# EasyEDA Pro project pcb-project.epro

# Schematic SCH

## Sheets
1 P1: Create Date: 2024-03-08; Page Name: P1; Project Name: 15P1D_EDA; Schematic Name: SCH; Update Date: 2024-04-02; Company: EDA设计与开发; Page Size: A4; Version: V1.0
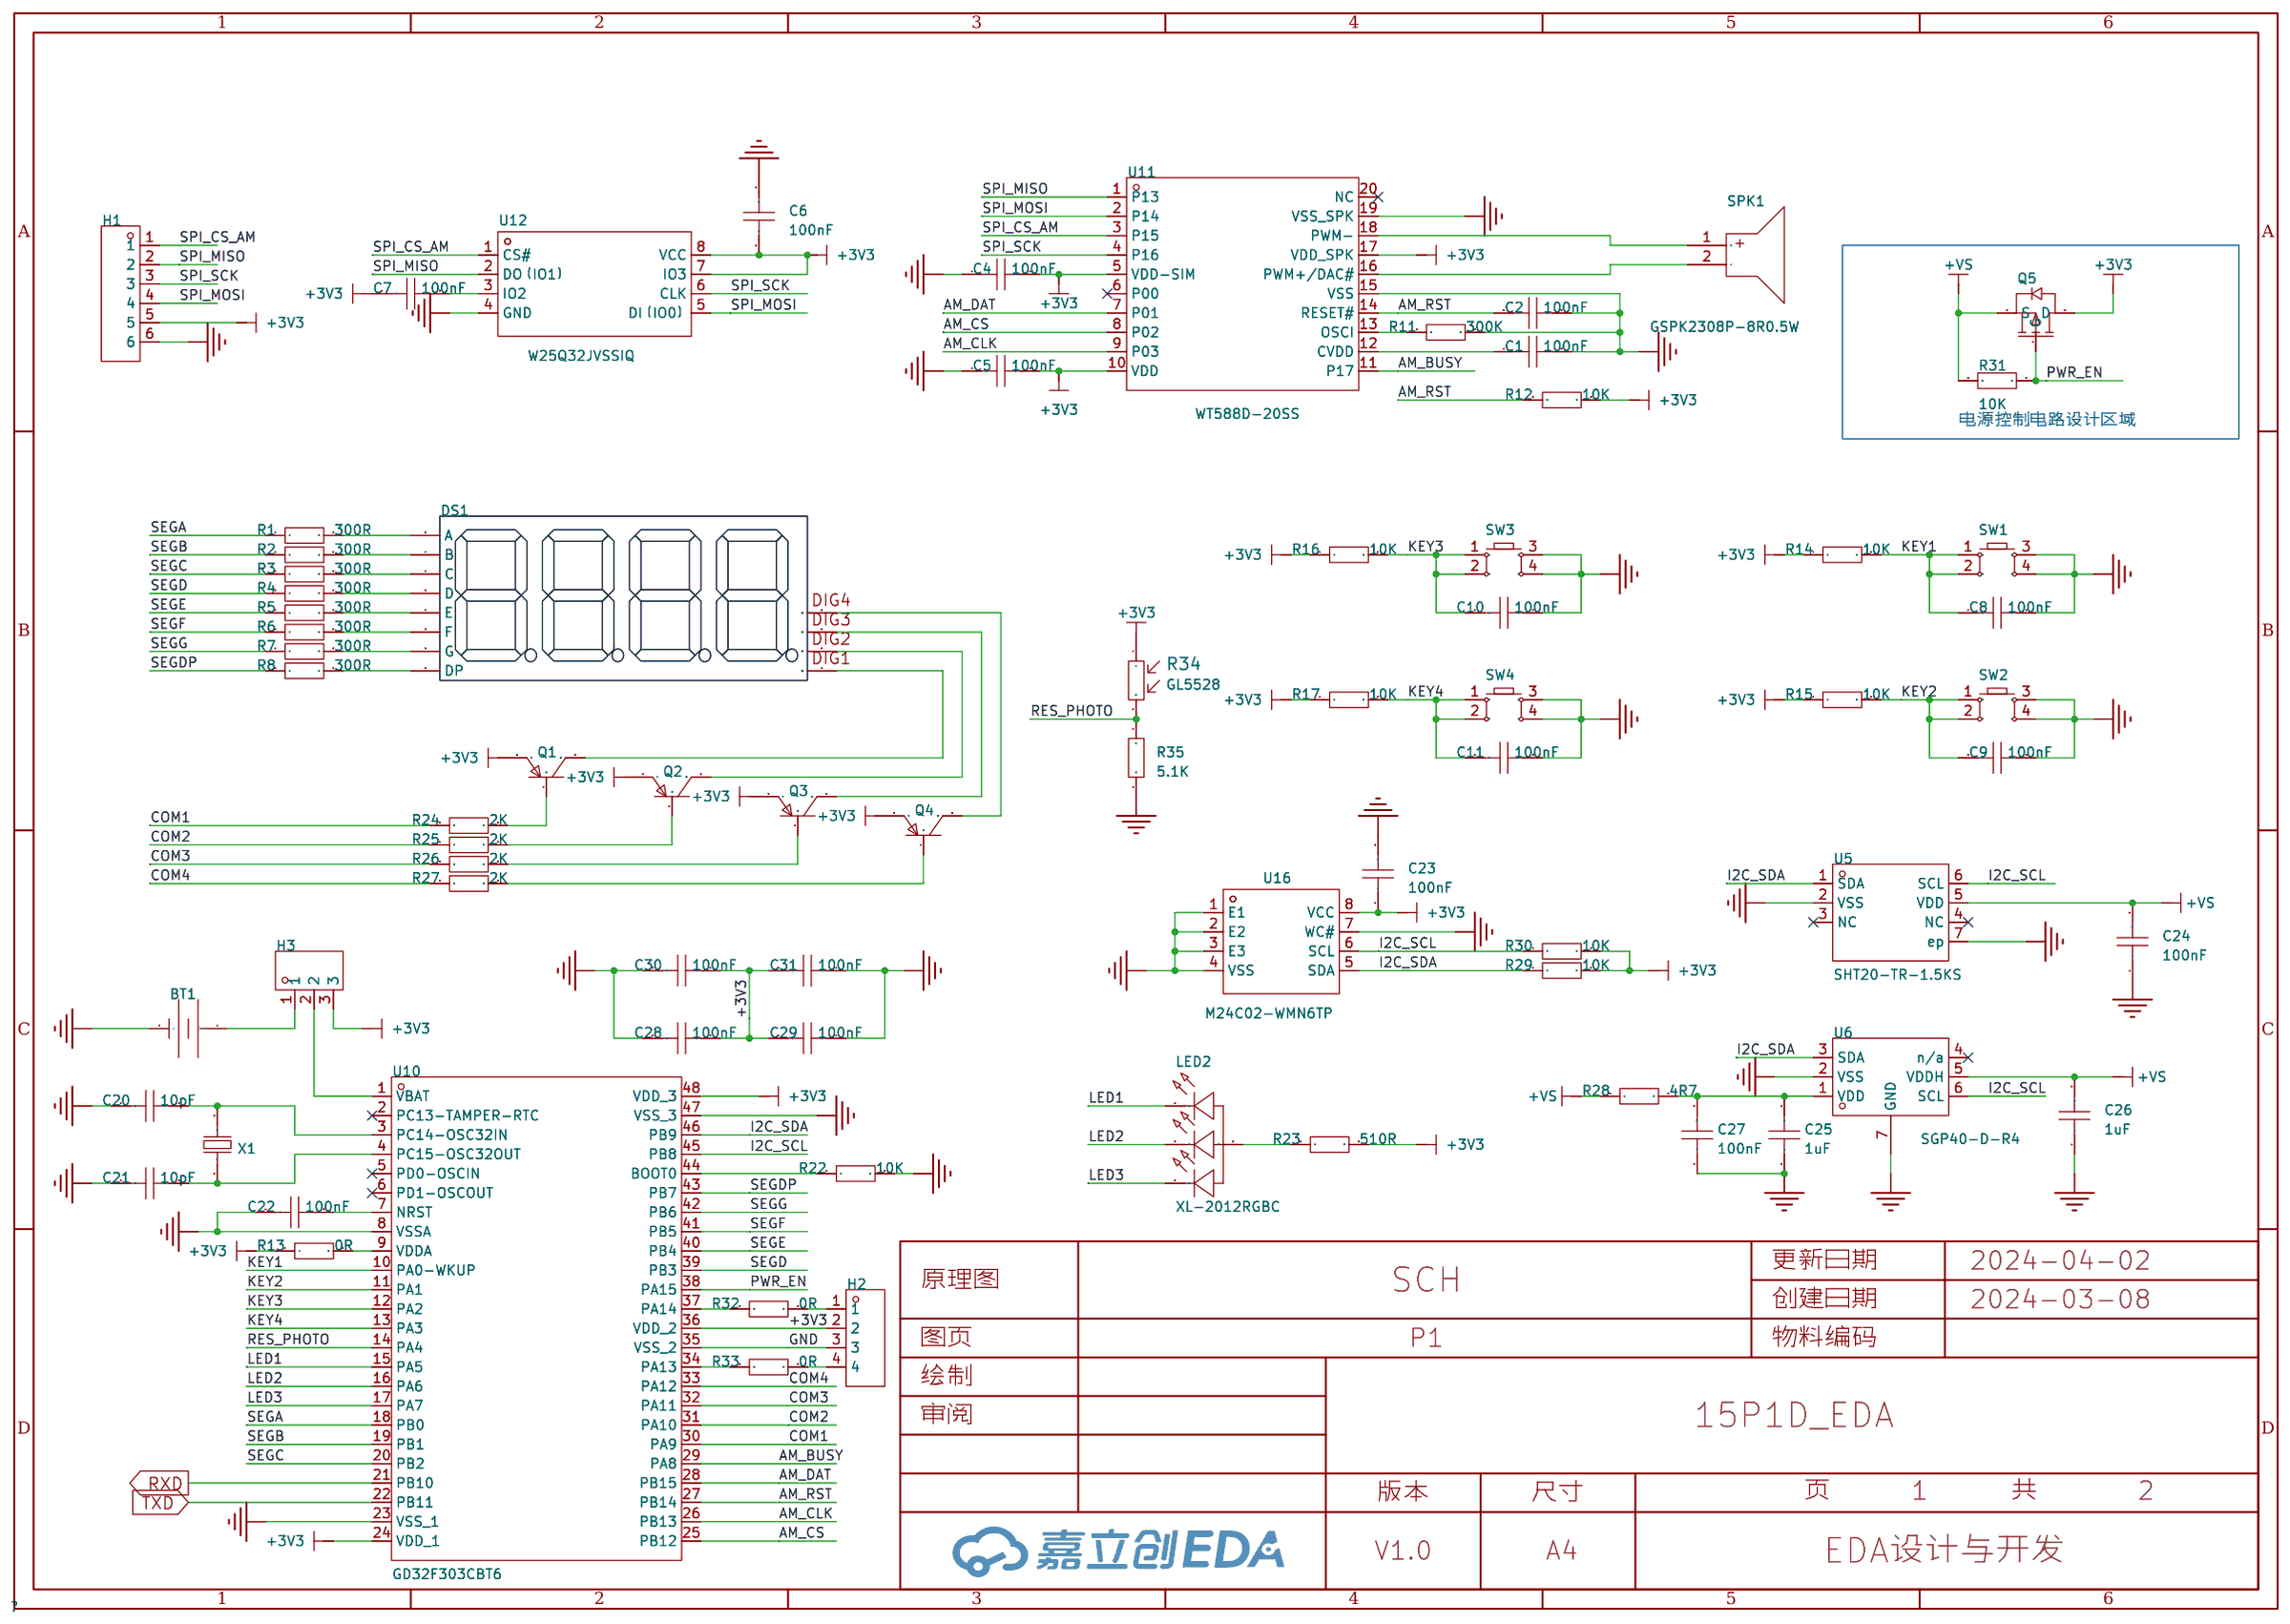
[diagram p0: P1]
2 P2: Create Date: 2024-03-12; Page Name: P2; Update Date: 2024-03-21; Company: 嘉立创EDA
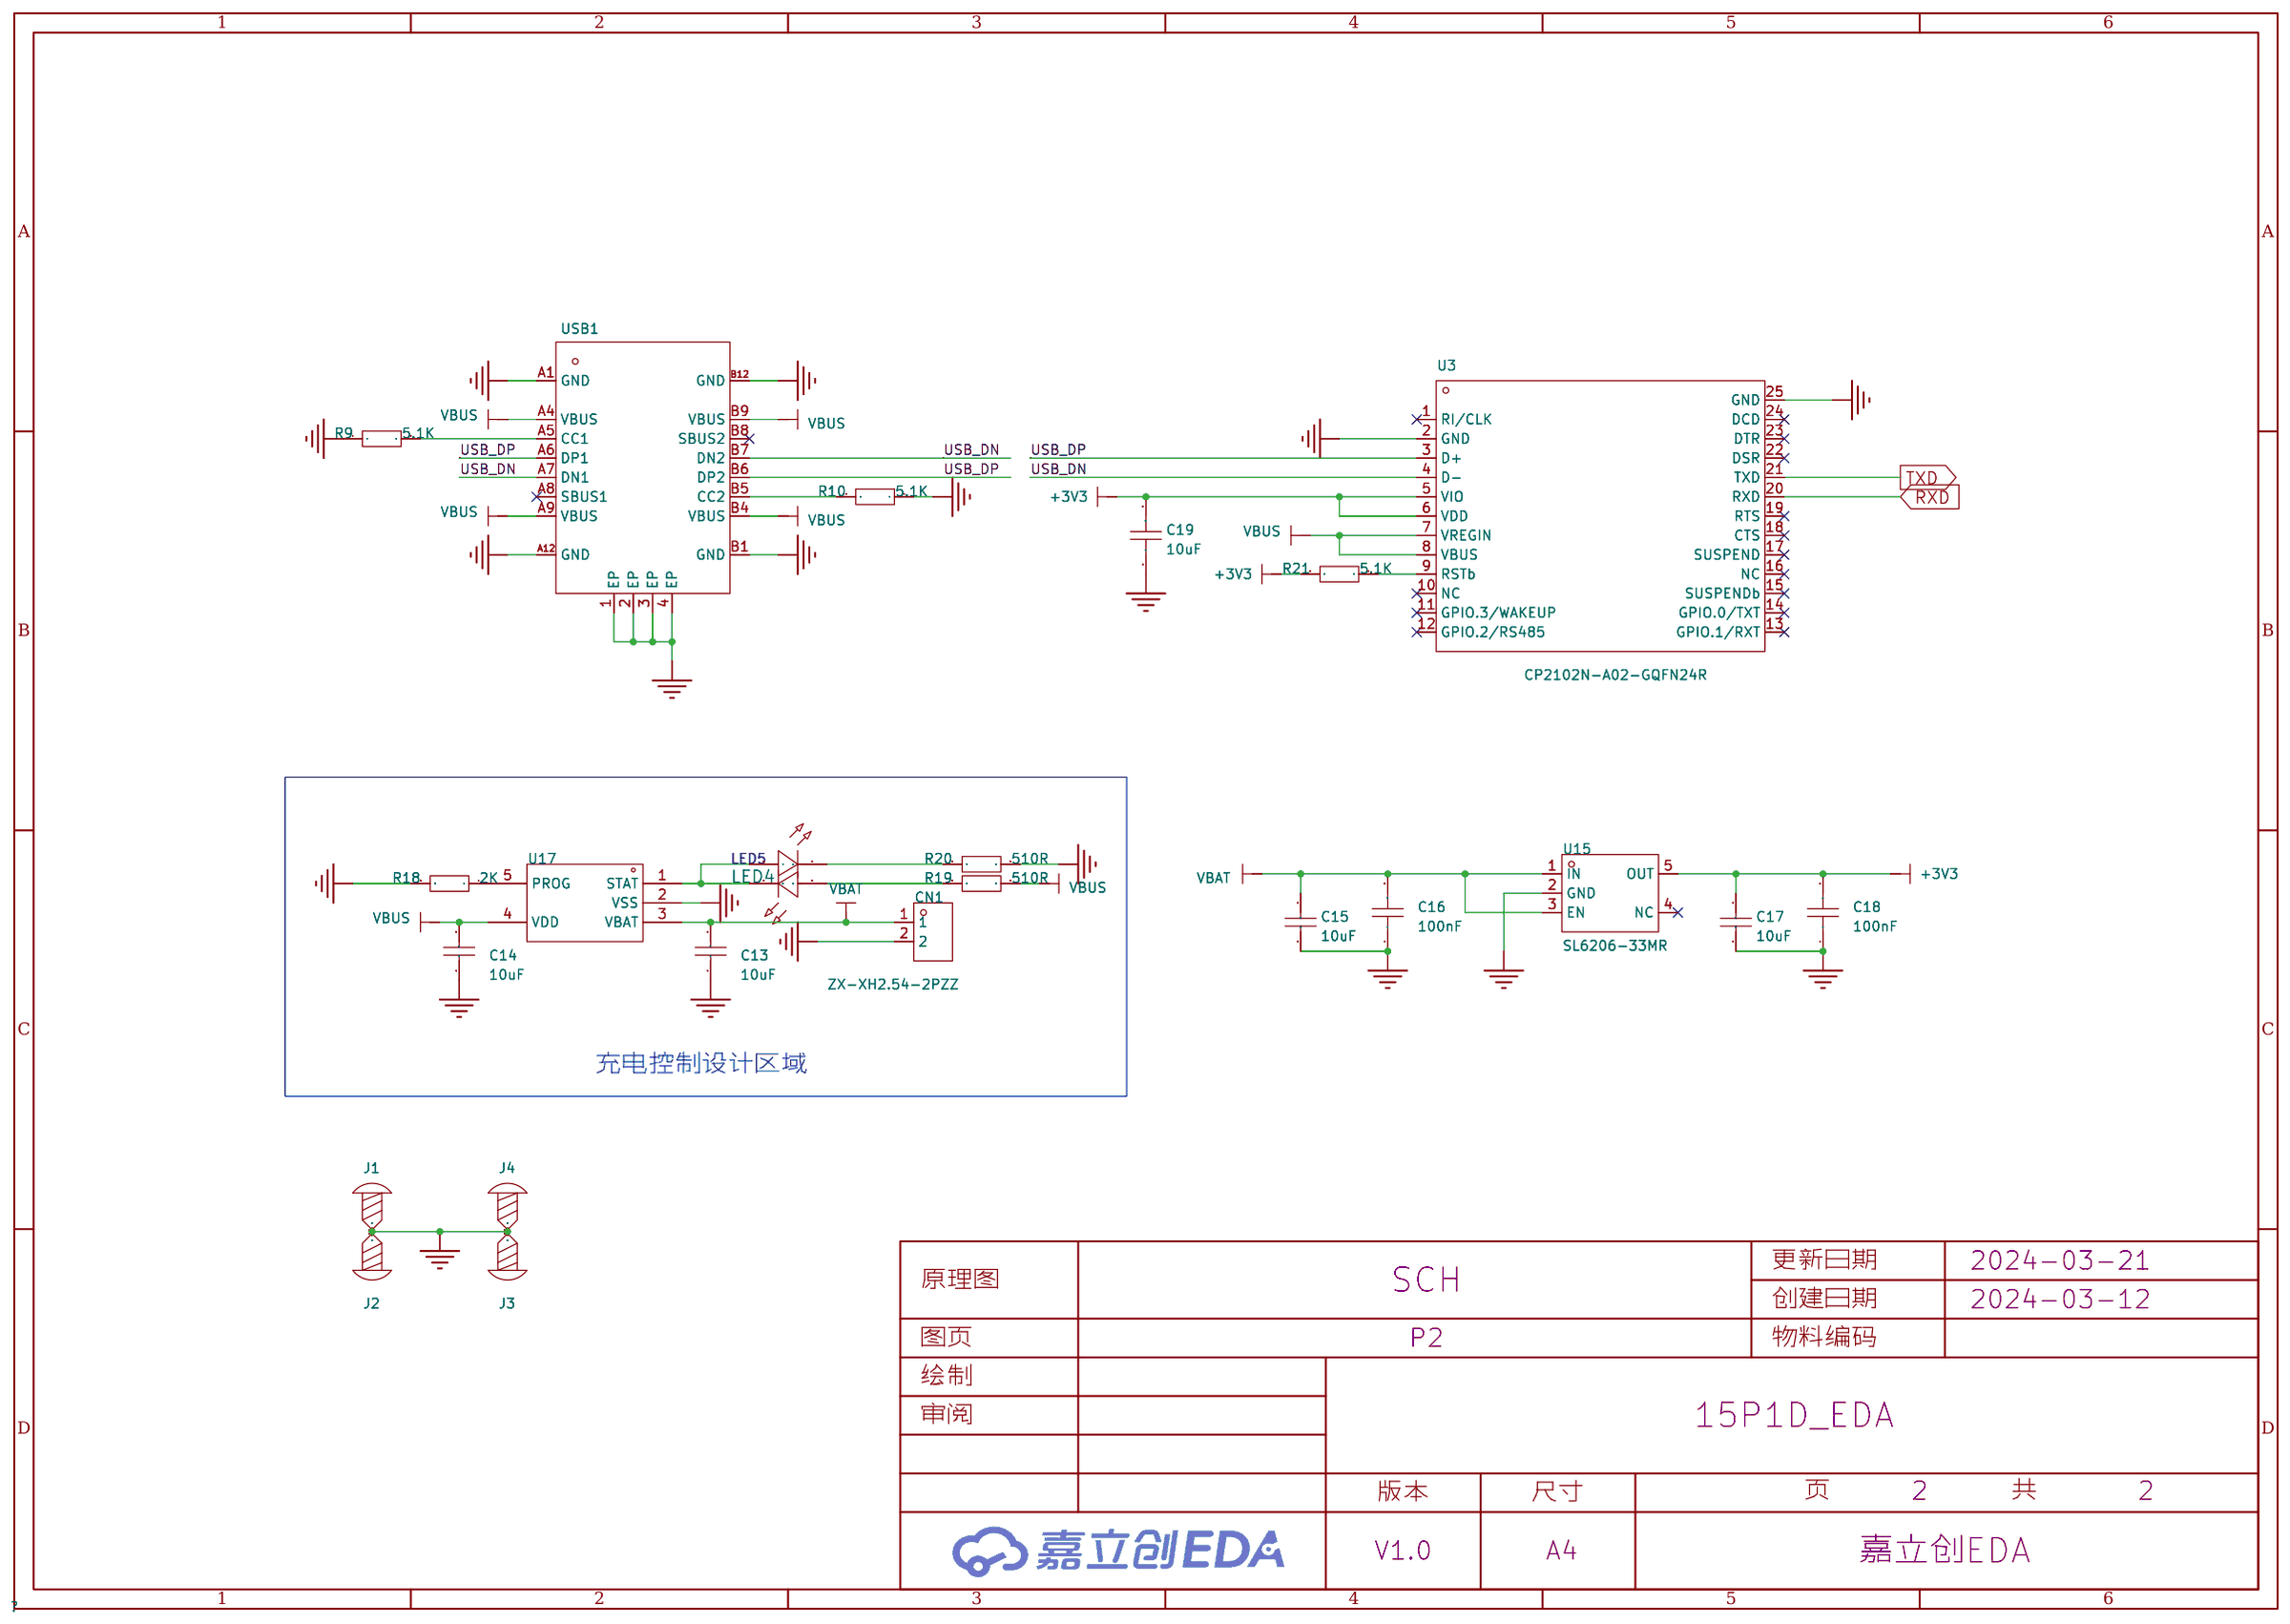
[diagram p1: P2]

## Parts
sheet P1
BT1  BS-12-B3AA003  [BAT-SMD_BS-12-B3AA011]
C1  100nF  [C0805]
C2  100nF  [C0805]
C4  100nF  [C0805]
C5  100nF  [C0805]
C6  100nF  [C0805]
C7  100nF  [C0805]
C8  100nF  [C0805]
C9  100nF  [C0805]
C10  100nF  [C0805]
C11  100nF  [C0805]
C20  10pF  [C0805]
C21  10pF  [C0805]
C22  100nF  [C0805]
C23  100nF  [C0805]
C24  100nF  [C0805]
C25  1uF  [C0805]
C26  1uF  [C0805]
C27  100nF  [C0805]
C28  100nF  [C0805]
C29  100nF  [C0805]
C30  100nF  [C0805]
C31  100nF  [C0805]
DS1  -  [LED-SEG-TH_FJ5461AH]
H1  -  [HDR-TH_6P-P2.54-V-F]
H2  -  [HDR-TH_4P-P2.54-V-F]
H3  Jumper3  [HDR-TH_3P-P2.54-V-M-A]
LED2  XL-2012RGBC  [LED-SMD_4P-L2.0-W1.3-BR]
Q1  -  [S8550P_SOT]
Q2  -  [S8550P_SOT]
Q3  -  [S8550P_SOT]
Q4  -  [S8550P_SOT]
Q5  -  [AO3401A_SOT-23-3]
R1  300R  [R0805]
R2  300R  [R0805]
R3  300R  [R0805]
R4  300R  [R0805]
R5  300R  [R0805]
R6  300R  [R0805]
R7  300R  [R0805]
R8  300R  [R0805]
R11  300K  [R0805]
R12  10K  [R0805]
R13  0R  [R0805]
R14  10K  [R0805]
R15  10K  [R0805]
R16  10K  [R0805]
R17  10K  [R0805]
R22  10K  [R0805]
R23  510R  [R0805]
R24  2K  [R0805]
R25  2K  [R0805]
R26  2K  [R0805]
R27  2K  [R0805]
R28  4R7  [R0805]
R29  10K  [R0805]
R30  10K  [R0805]
R31  10K  [R0805]
R32  0R  [R0805]
R33  0R  [R0805]
R34  GL5528  [RES-TH_L5.1-W4.3-P3.40-D0.5]
R35  5.1K  [R0805]
SPK1  GSPK2308P-8R0.5W  [SPK-TH_BD23.0-P10.00-D0.8-L-RD]
SW1  -  [Key_SMD_12x12x7.3]
SW2  -  [Key_SMD_12x12x7.3]
SW3  -  [Key_SMD_12x12x7.3]
SW4  -  [Key_SMD_12x12x7.3]
U5  SHT20-TR-1.5KS  [DFN-6_L3.0-W3.0-P0.95-TR-EP]
U6  SGP40-D-R4  [DFN-6_L2.4-W2.4-P0.80-TL-EP]
U10  GD32F303CBT6  [LQFP-48_L7.0-W7.0-P0.50-LS9.0-BL]
U11  WT588D-20SS  [SSOP-20_L7.2-W5.3-P0.65-LS7.8-BL]
U12  W25Q32JVSSIQ  [SOIC-8_L5.3-W5.3-P1.27-LS8.0-BL]
U16  M24C02-WMN6TP  [SOIC-8_L4.9-W3.9-P1.27-LS6.0-BL]
X1  32.768kHz  [FC-135R_L3.2-W1.5]
sheet P2
C13  10uF  [C1206]
C14  10uF  [C1206]
C15  10uF  [C1206]
C16  100nF  [C0805]
C17  10uF  [C1206]
C18  100nF  [C0805]
C19  10uF  [C0805]
CN1  ZX-XH2.54-2PZZ  [CONN-TH_2P-P2.50_HX25003-2A]
J1  -  [M2螺丝]
J2  -  [M2螺丝]
J3  -  [M2螺丝]
J4  -  [M2螺丝]
LED4  -  [LED_0805]
LED5  -  [LED_0805]
R9  5.1K  [R0805]
R10  5.1K  [R0805]
R18  2K  [R0805]
R19  510R  [R0805]
R20  510R  [R0805]
R21  5.1K  [R0805]
U3  CP2102N-A02-GQFN24R  [QFN-24_L4.0-W4.0-P0.50-TL-EP2.6]
U15  SL6206-33MR  [SOT-23-5_L2.9-W1.6-P0.95-LS2.8-BL]
U17  -  [SOP_BCON]
USB1  -  [USB_TYPE-C-16P]

## Library data of the parts
BT1 = BS-12-B3AA003: 连接器类型:电池底座;适用电池规格:CR1220;工作温度范围:-25℃~+85℃;; Supplier Part: C964723; Manufacturer: MYOUNG(美阳); Supplier Footprint: SMD; JLCPCB Part Class: 扩展库; Datasheet: https://atta.szlcsc.com/upload/public/pdf/source/20201218/C964723_733B638E287393F86295A2A4DAE43C75.pdf; Supplier: LCSC; Connector Type: 电池底座; Battery Type: CR1220; Operating Temperature Range: -25℃~+85℃
C1 C2 C4-C11 C16 C18-C31 = CAP_0805: Supplier Footprint: 0805
DS1 = LED_SEG_TH_0.56x4: Supplier Footprint: 插件
H1 = HDR-F_2.54_1x6P: Supplier Part: C40877; Supplier Footprint: 插件
H2 = HDR-F_2.54_1x4P: Supplier Part: C2718488; Supplier Footprint: 插件
H3 = Jumper3: Supplier Part: C2940050; Supplier Footprint: HDR-TH-3P-2.54mm; JLCPCB Part Class: 扩展库; Supplier: LCSC
LED2 = XL-2012RGBC: 发光颜色:RGB三色;功率:80mW；80mW；55mW;正向电流:25mA;主波长:619nm~624nm；463nm~466nm；524nm~527nm;二极管配置:-;透镜颜色:无色透明透镜;色温:-;发光角度:120°;载带方式:正贴;工作温度:-30℃~+85℃;; Supplier Part: C965848; Manufacturer: XINGLIGHT(成兴光); Supplier Footprint: 0805; JLCPCB Part Class: 扩展库; Datasheet: https://atta.szlcsc.com/upload/public/pdf/source/20221102/35E310354F68AE1BCFC07B93F5E395D6.pdf; Supplier: LCSC; Emitted Color: RGB三色; Power Dissipation: 80mW；80mW；55mW; Forward Current: 25mA; Dominant Wavelength: 619nm~624nm；463nm~466nm；524nm~527nm; Peak Wavelength: 624nm；528nm；469nm; Lens Color: 无色透明透镜; Viewing Angle: 120°; Mounting Sytle: 正贴; Operating Temperature: -30℃~+85℃
Q1-Q4 = S8550_SOT_PNP: Supplier Footprint: SOT-23
Q5 = AO3401A_P: Supplier Footprint: SOT-23-3L; Supplier Part: C15127
R1-R33 R35 = Res_0805: Supplier Footprint: 0805
R34 = GL5528: 暗电阻:1MΩ;亮电阻 @ 10Lux:8kΩ~20kΩ;光谱峰值(波长):540nm;; LCSC Part Name: 亮电阻:8kΩ~20kΩ 暗电阻:1MΩ; Supplier Part: C125627; Manufacturer: 森霸; Supplier Footprint: 插件,P=3mm; JLCPCB Part Class: 扩展库; Datasheet: https://atta.szlcsc.com/upload/public/pdf/source/20230427/842A99E3D53A83729D7968886D4EFCBB.pdf; Supplier: LCSC; Dark Resistance: 1MΩ; Illuminated Resistance @ 10Lux: 8kΩ~20kΩ; Applied Voltage: 150V; Spectral Peak: 540nm
SPK1 = GSPK2308P-8R0.5W: Supplier Part: C530532; Manufacturer: INGHAi(赢海); JLCPCB Part Class: 扩展库; Datasheet: https://atta.szlcsc.com/upload/public/pdf/source/20200723/C530532_3DB1F973601B36F20FBCCA52751811A3.pdf; Supplier: LCSC
SW1-SW4 = Key_SMD_12x12x7.3: Supplier Footprint: SMD
U5 = SHT20-TR-1.5KS: 接口类型:I2C;; LCSC Part Name: 1-100706-01; Supplier Part: C53865; Manufacturer: Sensirion(瑞士盛思锐); Supplier Footprint: DFN-6-EP(3x3); JLCPCB Part Class: 扩展库; Datasheet: https://atta.szlcsc.com/upload/public/pdf/source/20151012/1457707445424.pdf; Supplier: LCSC; Interface Type: I2C; Supply Voltage: 2.1V~3.6V
U6 = SGP40-D-R4: 气体类型:空气质量;精度:-;; LCSC Part Name: 3.000.384; Supplier Part: C2874215; Manufacturer: Sensirion(瑞士盛思锐); Supplier Footprint: DFN-6-EP(2.4x2.4); JLCPCB Part Class: 扩展库; Datasheet: https://atta.szlcsc.com/upload/public/pdf/source/20231011/67A6038984BE66B07B1FF2325C50691F.pdf; Supplier: LCSC; Type: 空气质量; Operating Temperature: -10℃~+50℃
U10 = GD32F303CBT6_C3013779: CPU内核:CM4;程序存储容量:128KB;RAM总容量:32KB;GPIO端口数量:37;工作电压范围:-;CPU最大主频:120MHz;程序存储器类型:FLASH;; Supplier Part: C3013779; Manufacturer: GigaDevice(兆易创新); Supplier Footprint: LQFP-48(7x7); JLCPCB Part Class: 扩展库; Datasheet: https://atta.szlcsc.com/upload/public/pdf/source/20220624/E1A57ED816B162D6D1424864911A792F.pdf; Supplier: LCSC; CPU Core: CM4; Program Storage Size: 128KB; RAM Size: 32KB; GPIO Ports Number: 37; CPU Maximum Speed: 120MHz; Program Memory Type: FLASH; ADC (Bit): 12bit; DAC (Bit): 12bit; 16Bit Timer: 7; CAN: 1; UART/USART: 3; I2C: 2; I2S: 2; SPI: 3; Peripheral/Function: 看门狗；RTC实时时钟; Watchdog: 有; Real-Time Clock: 有
U11 = WT588D-20SS: 高品质语音芯片; Supplier Part: C87498; Manufacturer: WT(唯创知音); Supplier Footprint: SSOP-20-208mil; JLCPCB Part Class: 扩展库; Datasheet: https://atta.szlcsc.com/upload/public/pdf/source/20161217/1481939141189.pdf; Supplier: LCSC
U12 = W25Q32JVSSIQ_C82344: 接口类型:SPI;存储容量:32Mbit;; Supplier Part: C82344; Manufacturer: WINBOND(华邦); Supplier Footprint: SOIC-8-208mil; JLCPCB Part Class: 扩展库; Datasheet: https://atta.szlcsc.com/upload/public/pdf/source/20160910/1473490310454.pdf; Supplier: LCSC; Interface Type: SPI; Memory Size: 32Mbit; Supply Voltage: 2.7V~3.6V; Page Programming Time (Tpp): 3ms; Operating Temperature: -40℃~+85℃
U16 = M24C02-WMN6TP: 接口类型:I2C;存储容量:2Kbit;; Supplier Part: C7562; Manufacturer: ST(意法半导体); Supplier Footprint: SOIC-8; JLCPCB Part Class: Extended Part; Datasheet: https://atta.szlcsc.com/upload/public/pdf/source/20140724/1457707167301.pdf; Supplier: LCSC; Interface Type: I2C; Memory Size: 2Kbit; Supply Voltage: 2.5V~5.5V; Operating Temperature: -40℃~+85℃
X1 = Q13FC13500004_C32346: 晶振类型:贴片晶振;频率:32.768kHz;常温频差:±20ppm;外接负载电容:12.5pF;; LCSC Part Name: 32.768kHz ±20ppm 12.5pF; Supplier Part: C32346; Manufacturer: EPSON(爱普生); Manufacturer Part: Q13FC13500004; Supplier Footprint: SMD3215-2P; JLCPCB Part Class: 基础库; Datasheet: https://atta.szlcsc.com/upload/public/pdf/source/20190108/C32346_746D6B07EAF90824457A96480007685F.pdf; Supplier: LCSC; Crystal Type: 贴片晶振; Normal temperature Frequency Tolerance: ±20ppm; External load capacitor: 12.5pF; Equivalent Series Resistance (ESR): 70kΩ; Operating Temperature: -40℃~+85℃
C13-C15 C17 = CL31A106KBHNNNE: 容值:10uF;精度:±10%;额定电压:50V;材质(温度系数):X5R;; LCSC Part Name: 10uF ±10% 50V; Supplier Part: C13585; Manufacturer: SAMSUNG(三星); Supplier Footprint: 1206; JLCPCB Part Class: 基础库; Datasheet: https://atta.szlcsc.com/upload/public/pdf/source/20160218/1457707763339.pdf; Supplier: LCSC; Tolerance: ±10%; Voltage Rated: 50V; Temperature Coefficient: X5R
CN1 = ZX-XH2.54-2PZZ: 插针结构:1x2P;间距:2.54mm;安装方式:直插;参考系列:XH;总PIN数:2P;排数:1;每排PIN数:2;行距:-;额定电流:3A;触头材质:黄铜;触头镀层:锡;工作温度范围:-25℃~+85℃;; Supplier Part: C7429632; Manufacturer: Megastar(兆星); Supplier Footprint: 插件,P=2.54mm; JLCPCB Part Class: 扩展库; Datasheet: https://atta.szlcsc.com/upload/public/pdf/source/20230619/19BA6947230AA44A04D3EDD65E618FD0.pdf; Supplier: LCSC; Pins Structure: 1x2P; Pitch: 2.54mm; Mounting Style: 直插; Reference Series: XH; Number of Pins: 2P; Number of Rows: 1; Number of PINs Per Row: 2; Current Rating (Max): 3A; Contact Material: 黄铜; Contact Plating: 锡; Operating Temperature Range: -25℃~+85℃
J1-J4 = M2螺丝: Supplier Footprint: 插件
LED4 = LED_0805-R: Supplier Footprint: 0805
LED5 = LED_0805-G: Supplier Footprint: 0805
U3 = CP2102N-A02-GQFN24R: 应用功能:USB转UART;接口协议:UART;; Supplier Part: C969151; Manufacturer: SKYWORKS/SILICON LABS(芯科); Supplier Footprint: QFN-24-EP(4x4); JLCPCB Part Class: 扩展库; Datasheet: https://atta.szlcsc.com/upload/public/pdf/source/20201204/C964632_F2B790CC23A72455AEF523510305B30A.pdf; Supplier: LCSC; Applications Function: USB转UART; Protocol: UART; Supply Voltage: 3V~3.6V; Operating Temperature: -40℃~+85℃@(Ta)
U15 = SL6206-33MR: 输出类型:-;; Supplier Part: C707122; Manufacturer: Slkor(萨科微); Supplier Footprint: SOT-23-5; JLCPCB Part Class: 扩展库; Datasheet: https://atta.szlcsc.com/upload/public/pdf/source/20200721/C707121_33633D17E61D5DC97F22208BE63A0FB1.pdf; Supplier: LCSC
U17 = BCON
USB1 = USB_TYPE-C-16P: Supplier Footprint: SMD

## Nets
+3V3: C4.2 C5.2 C6.2 C7.1 C17.2 C18.2 C19.2 C23.1 C28.1 C29.2 C30.1 C31.2 H1.5 H2.2 H3.3 Q1.2(E) Q2.2(E) Q3.2(E) Q4.2(E) Q5.3(D) R12.2 R13.1 R14.1 R15.1 R16.1 R17.1 R21.2 R23.2 R29.2 R30.2 R34.1 U3.5(VIO) U3.6(VDD) U10.24(VDD_1) U10.36(VDD_2) U10.48(VDD_3) U11.5(VDD-SIM) U11.10(VDD) U11.17(VDD_SPK) U12.7(IO3) U12.8(VCC) U15.5(OUT) U16.8(VCC)
GND: BT1.2(-) C1.2 C2.2 C4.1 C5.1 C6.1 C8.2 C9.2 C10.2 C11.2 C13.2 C14.2 C15.1 C16.1 C17.1 C18.1 C19.1 C20.1 C21.1 C22.1 C23.2 C24.1 C25.1 C26.1 C27.1 C28.2 C29.1 C30.2 C31.1 CN1.2 H1.6 H2.3 J1.1 J2.1 J3.1 J4.1 R9.1 R10.1 R11.2 R18.2 R20.1 R22.2 R35.2 SW1.3 SW1.4 SW2.3 SW2.4 SW3.3 SW3.4 SW4.3 SW4.4 U3.2(GND) U3.25(GND) U5.2(VSS) U5.7(ep) U6.2(VSS) U6.7(GND) U10.8(VSSA) U10.23(VSS_1) U10.35(VSS_2) U10.47(VSS_3) U11.15(VSS) U11.19(VSS_SPK) U12.4(GND) U15.2(GND) U16.1(E1) U16.2(E2) U16.3(E3) U16.4(VSS) U16.7(WC#) U17.2(VSS) USB1.1(EP) USB1.2(EP) USB1.3(EP) USB1.4(EP) USB1.A1(GND) USB1.A12(GND) USB1.B1(GND) USB1.B12(GND)
VBAT: C13.1 C15.2 C16.2 CN1.1 U15.1(IN) U15.3(EN) U17.3(VBAT)
VBUS: C14.1 R19.1 U3.7(VREGIN) U3.8(VBUS) U17.4(VDD) USB1.A4(VBUS) USB1.A9(VBUS) USB1.B4(VBUS) USB1.B9(VBUS)
+VS: C24.2 C26.2 Q5.2(S) R28.1 R31.2 U5.5(VDD) U6.5(VDDH)
AM_BUSY: U10.29(PA8) U11.11(P17)
AM_CLK: U10.26(PB13) U11.9(P03)
AM_CS: U10.25(PB12) U11.8(P02)
AM_DAT: U10.28(PB15) U11.7(P01)
AM_RST: C2.1 R12.1 U10.27(PB14) U11.14(RESET#)
COM1: R24.1 U10.30(PA9)
COM2: R25.1 U10.31(PA10)
COM3: R26.1 U10.32(PA11)
COM4: R27.1 U10.33(PA12)
I2C_SCL: R30.1 U5.6(SCL) U6.6(SCL) U10.45(PB8) U16.6(SCL)
I2C_SDA: R29.1 U5.1(SDA) U6.3(SDA) U10.46(PB9) U16.5(SDA)
KEY1: C8.1 R14.2 SW1.1 SW1.2 U10.10(PA0-WKUP)
KEY2: C9.1 R15.2 SW2.1 SW2.2 U10.11(PA1)
KEY3: C10.1 R16.2 SW3.1 SW3.2 U10.12(PA2)
KEY4: C11.1 R17.2 SW4.1 SW4.2 U10.13(PA3)
LED1: LED2.1 U10.15(PA5)
LED2: LED2.2 U10.16(PA6)
LED3: LED2.4 U10.17(PA7)
PWR_EN: Q5.1(G) R31.1 U10.38(PA15)
RES_PHOTO: R34.2 R35.1 U10.14(PA4)
RXD: U3.20(RXD) U10.21(PB10)
SEGA: R1.1 U10.18(PB0)
SEGB: R2.1 U10.19(PB1)
SEGC: R3.1 U10.20(PB2)
SEGD: R4.1 U10.39(PB3)
SEGDP: R8.1 U10.43(PB7)
SEGE: R5.1 U10.40(PB4)
SEGF: R6.1 U10.41(PB5)
SEGG: R7.1 U10.42(PB6)
SPI_CS_AM: H1.1 U11.3(P15) U12.1(CS#)
SPI_MISO: H1.2 U11.1(P13) U12.2(DO（IO1）)
SPI_MOSI: H1.4 U11.2(P14) U12.5(DI（IO0）)
SPI_SCK: H1.3 U11.4(P16) U12.6(CLK)
TXD: U3.21(TXD) U10.22(PB11)
USB_DN: U3.4(D-) USB1.A7(DN1) USB1.B7(DN2)
USB_DP: U3.3(D+) USB1.A6(DP1) USB1.B6(DP2)
$1N1449: DS1.8(DIG3) Q3.3(C)
$1N1467: DS1.1(E) R5.2
$1N1471: DS1.2(D) R4.2
$1N1475: DS1.3(DP) R8.2
$1N1479: DS1.4(C) R3.2
$1N1483: DS1.5(G) R7.2
$1N1487: DS1.11(A) R1.2
$1N1491: DS1.7(B) R2.2
$1N1495: DS1.10(F) R6.2
$1N6161: C1.1 U11.12(CVDD)
$1N6192: R11.1 U11.13(OSCI)
$1N6375: SPK1.1(+) U11.18(PWM-)
$1N6384: SPK1.2(-) U11.16(PWM+/DAC#)
$1N6917: C7.2 U12.3(IO2)
$1N7212: R13.2 U10.9(VDDA)
$1N7925: C20.2 U10.3(PC14-OSC32IN) X1.1
$1N7930: C21.2 U10.4(PC15-OSC32OUT) X1.2
$1N8028: R22.1 U10.44(BOOT0)
$1N8104: LED2.3 R23.1
$1N8256: DS1.12(DIG1) Q1.3(C)
$1N8335: DS1.9(DIG2) Q2.3(C)
$1N8343: DS1.6(DIG4) Q4.3(C)
$1N8477: Q1.1(B) R24.2
$1N8481: Q2.1(B) R25.2
$1N8485: Q3.1(B) R26.2
$1N8489: Q4.1(B) R27.2
$1N8598: C22.2 U10.7(NRST)
$1N9384: C25.2 C27.2 R28.2 U6.1(VDD)
$1N9794: R32.1 U10.37(PA14)
$1N9795: H2.1 R32.2
$1N9824: R33.1 U10.34(PA13)
$1N9825: H2.4 R33.2
$1N10132: BT1.1(+) H3.1
$1N10135: H3.2 U10.1(VBAT)
$2N394: R9.2 USB1.A5(CC1)
$2N397: R10.2 USB1.B5(CC2)
$2N1836: R21.1 U3.9(RSTb)
$2N6293: R18.1 U17.5(PROG)
$2N6364: LED4.1(C) LED5.2(A) U17.1(STAT)
$2N6379: LED5.1(C) R20.2
$2N6385: LED4.2(A) R19.2

Not connected (* = marked no-connect by the designer): U3 1(RI/CLK)* 10(NC)* 11(GPIO.3/WAKEUP)* 12(GPIO.2/RS485)* 13(GPIO.1/RXT)* 14(GPIO.0/TXT)* 15(SUSPENDb)* 16(NC)* 17(SUSPEND)* 18(CTS)* 19(RTS)* 22(DSR)* 23(DTR)* 24(DCD)*; U5 3(NC)* 4(NC)*; U6 4(n/a)*; U10 2(PC13-TAMPER-RTC)* 5(PD0-OSCIN)* 6(PD1-OSCOUT)*; U11 6(P00)* 20(NC)*; U15 4(NC)*; USB1 A8(SBUS1)* B8(SBUS2)*

## Notes on the sheets
sheet 1
- 电源控制电路设计区域
sheet 2
- 充电控制设计区域

# Board PCB
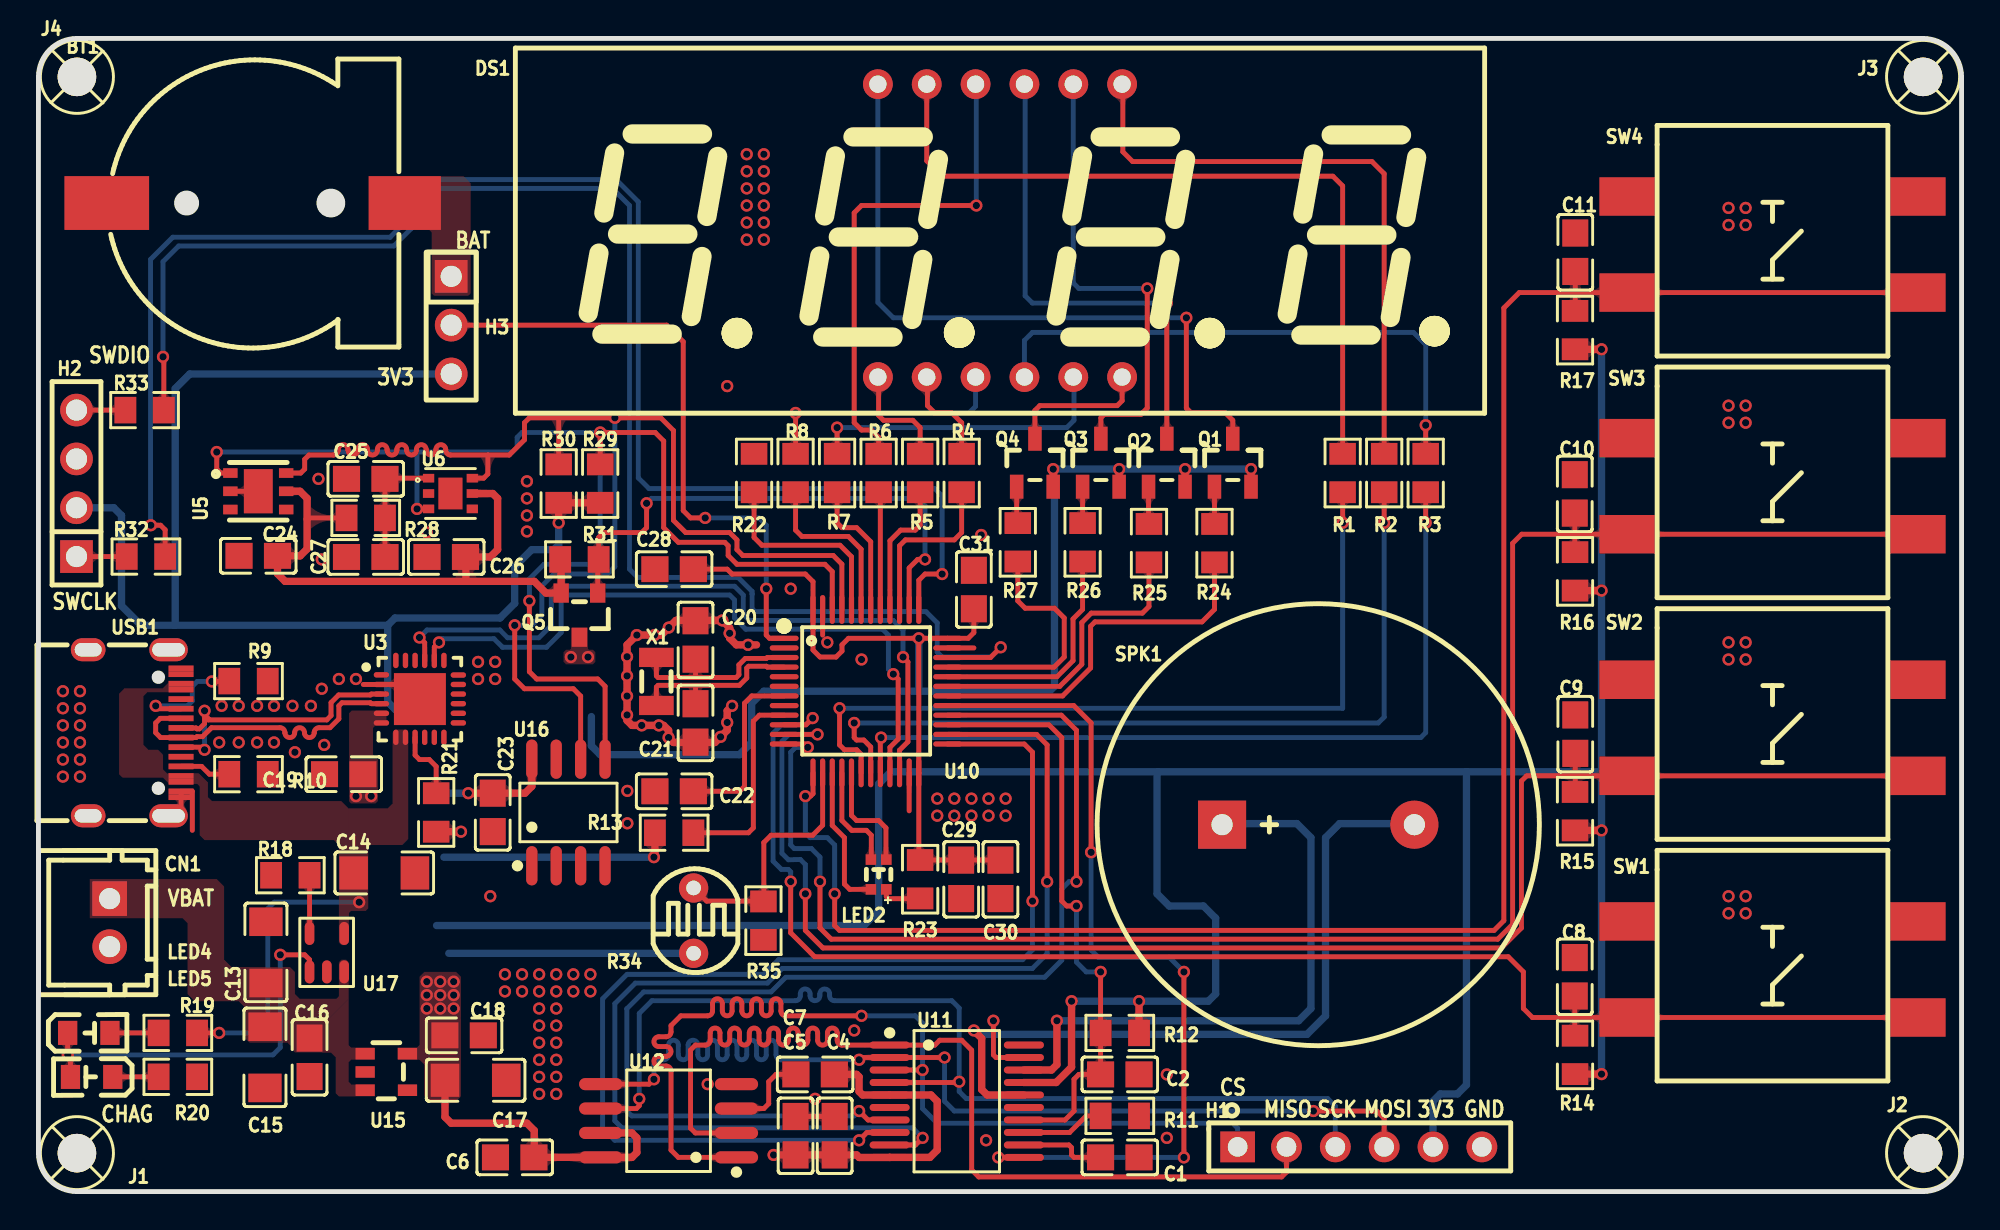
[diagram p2: board, top side]
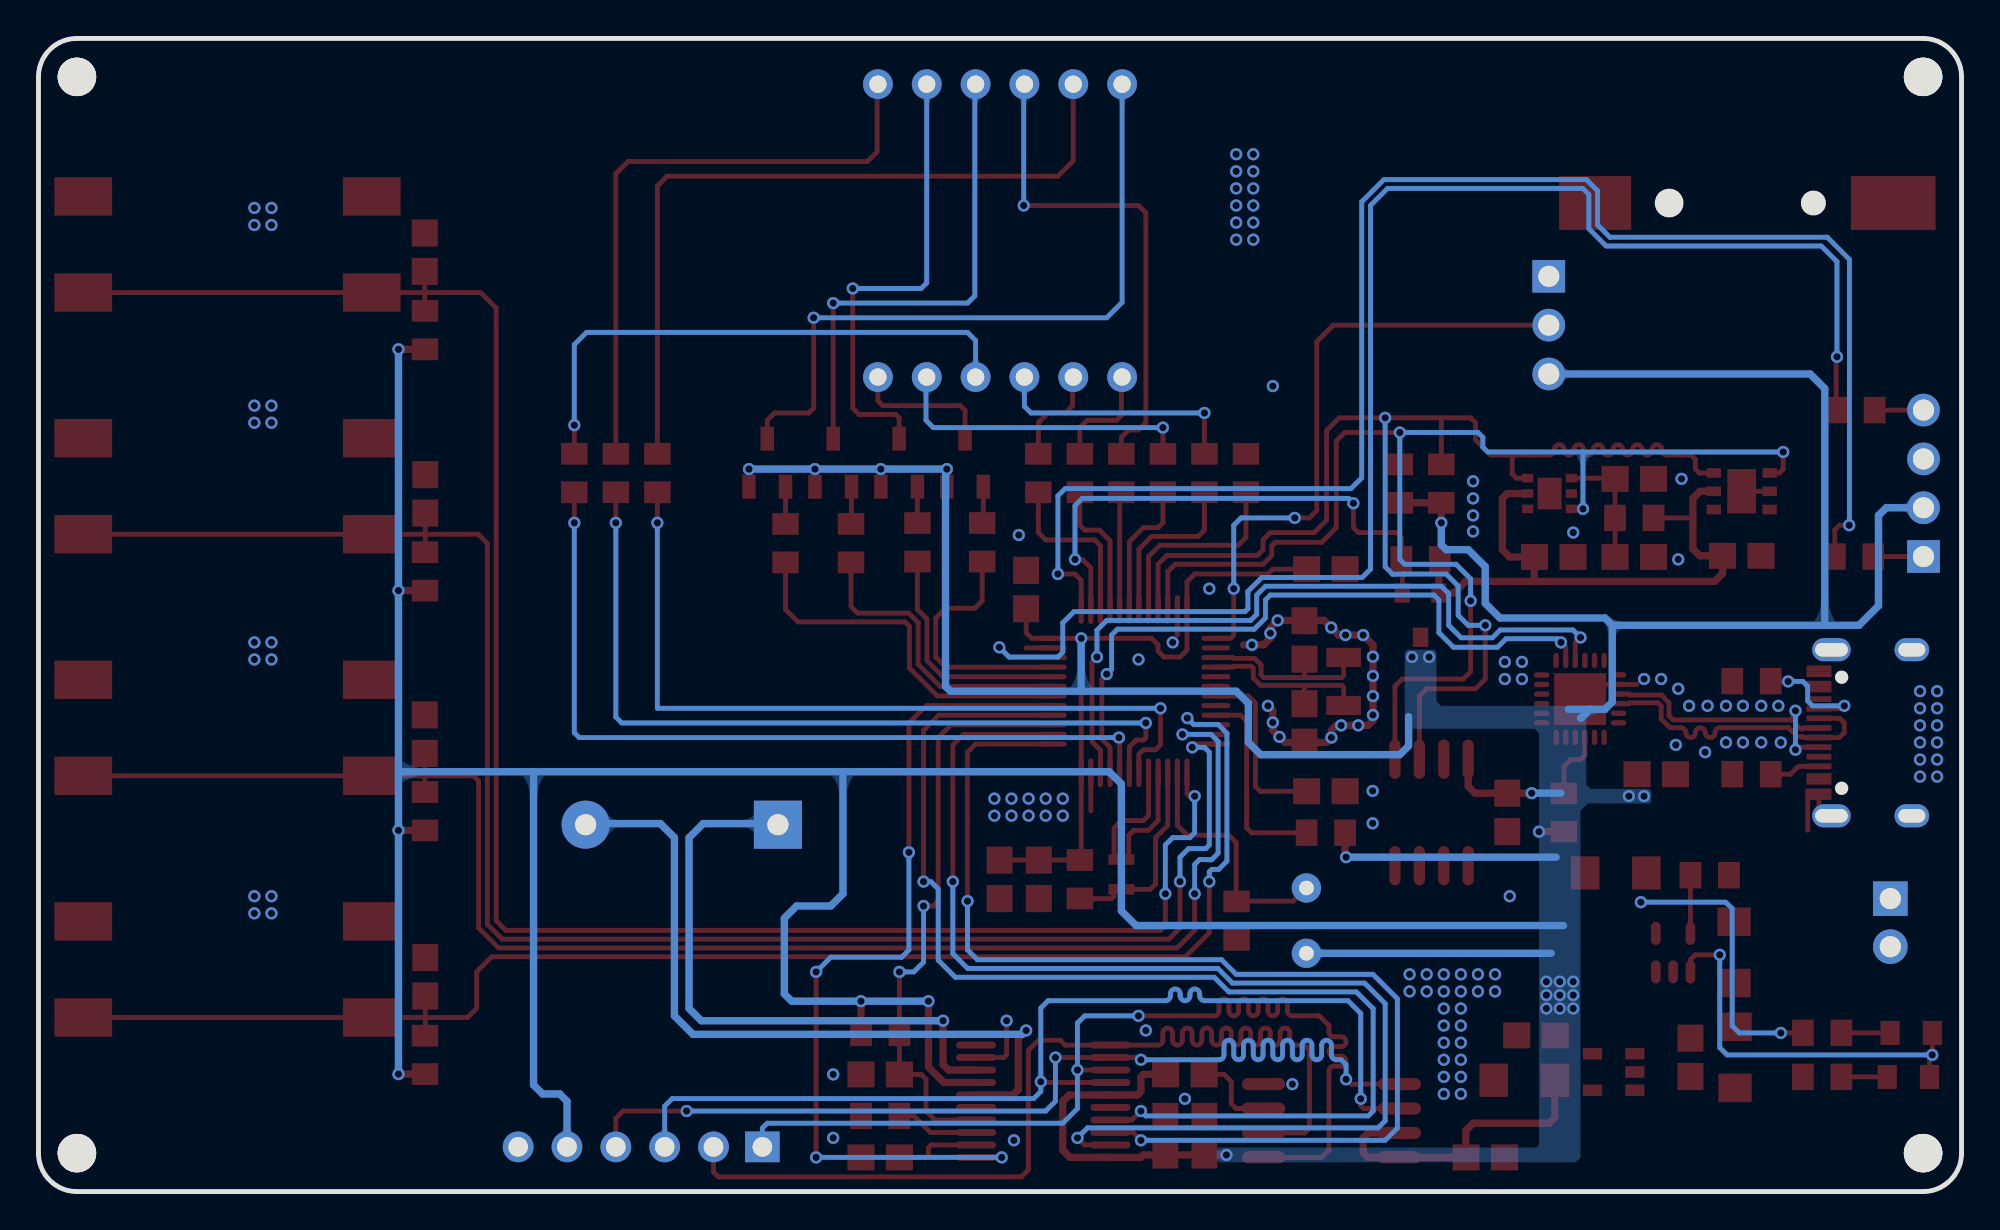
[diagram p3: board, bottom side, seen from below]

Outline 100 x 60 mm; copper layers: Top Layer, Bottom Layer. Coordinates in mm from the lower left corner of the outline.
Outline path: 0,58 0,2 arc(0.59,0.59) 2,0 98,0 arc(99.41,0.59) 100,2 100,58 arc(99.41,59.41) 98,60 2,60 arc(0.59,59.41) 0,58
Stack: Top Layer 0.035mm / Dielectric1 1.51mm FR4 er 4.5 / Bottom Layer 0.035mm

## Design rules (mm)
net $1N7925: DP1
net $1N7930: DP1
net USB_DP: DP2
net USB_DN: DP2
template: 自定义配置
spacing copperThickness1oz (default): track to track 0.203, other pairs 0.178 to 0.203
track width copperThickness1oz (default): min 0.254, default 0.254, max 2.54
track width power: min 0.254, default 0.381, max 2.54
differential pair differentialPair (default): width min 0.127, default 0.254, max 2.54; gap min 0.152, default 0.152
via viaSize (default): diameter min 0.635, default 0.635, max 10; hole min 0.381, default 0.381, max 6.299
net +3V3 uses power
net +VS uses power
net VBUS uses power
net VBAT uses power

## Placement (name value [footprint] x y rotation side)
BT1  BS-12-B3AA003  [BAT-SMD_BS-12-B3AA011]  11.3 51.44 0 top
C1  100nF  [C0805]  56.23 1.78 0 top
C2  100nF  [C0805]  56.23 6.1 0 top
C4  100nF  [C0805]  41.4 2.91 270 top
C5  100nF  [C0805]  39.37 2.91 270 top
C6  100nF  [C0805]  24.77 1.78 0 top
C7  100nF  [C0805]  40.39 6.1 180 top
C8  100nF  [C0805]  79.89 11.18 90 top
C9  100nF  [C0805]  79.91 23.8 90 top
C10  100nF  [C0805]  79.89 36.3 90 top
C11  100nF  [C0805]  79.91 48.88 90 top
C13  10uF  [C1206]  11.83 12.45 90 top
C14  10uF  [C1206]  17.98 16.58 0 top
C15  10uF  [C1206]  11.78 6.99 90 top
C16  100nF  [C0805]  14.1 6.99 90 top
C17  10uF  [C1206]  22.73 5.79 180 top
C18  100nF  [C0805]  22.13 8.13 180 top
C19  10uF  [C0805]  15.88 21.72 0 top
C20  10pF  [C0805]  34.17 28.7 270 top
C21  10pF  [C0805]  34.17 24.38 90 top
C22  100nF  [C0805]  33.06 20.83 0 top
C23  100nF  [C0805]  23.62 19.73 270 top
C24  100nF  [C0805]  11.43 33.08 0 top
C25  1uF  [C0805]  17.02 37.08 0 top
C26  1uF  [C0805]  21.2 33.02 0 top
C27  100nF  [C0805]  17.02 33.02 0 top
C28  100nF  [C0805]  33.06 32.39 180 top
C29  100nF  [C0805]  47.98 16.25 90 top
C30  100nF  [C0805]  50.02 16.25 270 top
C31  100nF  [C0805]  48.64 31.33 270 top
CN1  ZX-XH2.54-2PZZ  [CONN-TH_2P-P2.50_HX25003-2A]  3.7 13.99 270 top
DS1  -  [LED-SEG-TH_FJ5461AH]  50 50 0 top
H1  -  [HDR-TH_6P-P2.54-V-F]  68.71 2.32 0 top
H2  -  [HDR-TH_4P-P2.54-V-F]  1.98 36.85 90 top
H3  Jumper3  [HDR-TH_3P-P2.54-V-M-A]  21.46 45.08 270 top
J1  -  [M2螺丝]  2 2 0 top
J2  -  [M2螺丝]  98 2 0 top
J3  -  [M2螺丝]  98 58 0 top
J4  -  [M2螺丝]  2 58 0 top
LED2  XL-2012RGBC  [LED-SMD_4P-L2.0-W1.3-BR]  43.69 16.5 270 top
LED4  -  [LED_0805]  2.67 8.25 0 top
LED5  -  [LED_0805]  2.72 5.97 180 top
Q1  -  [S8550P_SOT]  62.1 37.97 270 top
Q2  -  [S8550P_SOT]  58.67 37.97 270 top
Q3  -  [S8550P_SOT]  55.25 37.97 270 top
Q4  -  [S8550P_SOT]  51.82 37.97 270 top
Q5  -  [AO3401A_SOT-23-3]  28.13 29.99 90 top
R1  300R  [R0805]  67.82 37.39 90 top
R2  300R  [R0805]  69.98 37.39 90 top
R3  300R  [R0805]  72.14 37.39 90 top
R4  300R  [R0805]  48.01 37.39 90 top
R5  300R  [R0805]  45.85 37.39 90 top
R6  300R  [R0805]  43.69 37.39 90 top
R7  300R  [R0805]  41.53 37.39 90 top
R8  300R  [R0805]  39.37 37.39 90 top
R9  5.1K  [R0805]  10.92 26.56 180 top
R10  5.1K  [R0805]  10.92 21.72 180 top
R11  300K  [R0805]  56.23 3.94 0 top
R12  10K  [R0805]  56.23 8.25 0 top
R13  0R  [R0805]  33.06 18.67 0 top
R14  10K  [R0805]  79.9 7.11 90 top
R15  10K  [R0805]  79.9 19.79 90 top
R16  10K  [R0805]  79.9 32.27 90 top
R17  10K  [R0805]  79.9 44.82 90 top
R18  2K  [R0805]  13.1 16.46 180 top
R19  510R  [R0805]  7.25 8.25 180 top
R20  510R  [R0805]  7.25 5.97 180 top
R21  5.1K  [R0805]  20.68 19.72 270 top
R22  10K  [R0805]  37.21 37.39 90 top
R23  510R  [R0805]  45.85 16.25 90 top
R24  2K  [R0805]  61.15 33.74 90 top
R25  2K  [R0805]  57.75 33.74 90 top
R26  2K  [R0805]  54.29 33.78 90 top
R27  2K  [R0805]  50.93 33.78 90 top
R28  4R7  [R0805]  17.02 35.05 0 top
R29  10K  [R0805]  29.21 36.84 270 top
R30  10K  [R0805]  27.05 36.84 270 top
R31  10K  [R0805]  28.13 32.89 180 top
R32  0R  [R0805]  5.59 33.04 180 top
R33  0R  [R0805]  5.52 40.66 180 top
R34  GL5528  [RES-TH_L5.1-W4.3-P3.40-D0.5]  34.07 14.1 180 top
R35  5.1K  [R0805]  37.7 14.1 270 top
SPK1  GSPK2308P-8R0.5W  [SPK-TH_BD23.0-P10.00-D0.8-L-RD]  66.55 19.09 0 top
SW1  -  [Key_SMD_12x12x7.3]  90.17 11.56 0 top
SW2  -  [Key_SMD_12x12x7.3]  90.17 24.13 0 top
SW3  -  [Key_SMD_12x12x7.3]  90.17 36.7 0 top
SW4  -  [Key_SMD_12x12x7.3]  90.17 49.28 0 top
U3  CP2102N-A02-GQFN24R  [QFN-24_L4.0-W4.0-P0.50-TL-EP2.6]  19.83 25.64 0 top
U5  SHT20-TR-1.5KS  [DFN-6_L3.0-W3.0-P0.95-TR-EP]  11.43 36.44 90 top
U6  SGP40-D-R4  [DFN-6_L2.4-W2.4-P0.80-TL-EP]  21.42 36.32 0 top
U10  GD32F303CBT6  [LQFP-48_L7.0-W7.0-P0.50-LS9.0-BL]  43.03 26.04 270 top
U11  WT588D-20SS  [SSOP-20_L7.2-W5.3-P0.65-LS7.8-BL]  47.75 4.7 270 top
U12  W25Q32JVSSIQ  [SOIC-8_L5.3-W5.3-P1.27-LS8.0-BL]  32.77 3.69 90 top
U15  SL6206-33MR  [SOT-23-5_L2.9-W1.6-P0.95-LS2.8-BL]  18.09 6.22 270 top
U16  M24C02-WMN6TP  [SOIC-8_L4.9-W3.9-P1.27-LS6.0-BL]  27.56 19.72 0 top
U17  -  [SOP_BCON]  14.1 11.43 90 top
USB1  -  [USB_TYPE-C-16P]  5 24 270 top
X1  32.768kHz  [FC-135R_L3.2-W1.5]  32.13 26.54 270 top

## Footprints (pads in the part's own frame, mm; a bottom-side part is the same pattern mirrored in y, then rotated)
AO3401A_SOT-23-3
  rect 1x0.8 smd: 1(1.15,-0.95) 2(1.15,0.95) 3(-1.15,0)
BAT-SMD_BS-12-B3AA011
  rect 3.75x2.8 smd: 1(7.75,0)
  rect 4.4x2.8 smd: 2(-7.75,0)
C0805
  rect 1.41x1.35 smd: 1(-1,0) 2(1,0)
C1206
  rect 1.485x1.728 smd: 1(-1.593,0) 2(1.593,0)
CONN-TH_2P-P2.50_HX25003-2A
  rect 1.8x1.8 hole 1.1: 1(-1.25,0)
  round 1.8 hole 1.1: 2(1.25,0)
DFN-6_L2.4-W2.4-P0.80-TL-EP
  rect 0.585x0.448 smd: 1(-1.137,0.8) 2(-1.137,0) 3(-1.137,-0.8) 4(1.137,-0.8) 5(1.137,0) 6(1.137,0.8)
  rect 1.25x1.65 smd: 7(0,0)
DFN-6_L3.0-W3.0-P0.95-TR-EP
  rect 0.5x0.75 smd: 1(0.95,1.452) 2(0,1.451) 3(-0.95,1.45) 4(-0.95,-1.452) 5(0,-1.452) 6(0.95,-1.451)
  rect 2.3x1.5 smd: 7(0.004,-0.001)
FC-135R_L3.2-W1.5
  rect 1x1.8 smd: 1(-1.25,0) 2(1.25,0)
HDR-TH_3P-P2.54-V-M-A
  rect 1.7x1.7 hole 1.1: 1(-2.54,0)
  round 1.7 hole 1.1: 2(0,0) 3(2.54,0)
HDR-TH_4P-P2.54-V-F
  rect 1.7x1.7 hole 1.1: 1(-3.81,0)
  round 1.7 hole 1.1: 2(-1.27,0) 3(1.27,0) 4(3.81,0)
HDR-TH_6P-P2.54-V-F
  rect 1.8x1.6 hole 1.02: 1(-6.35,0)
  round 1.6 hole 1.02: 2(-3.81,0) 3(-1.27,0) 4(1.27,0) 5(3.81,0) 6(6.35,0)
Key_SMD_12x12x7.3
  rect 2.999x1.999 smd: 1(-7.5,-2.499) 2(7.5,-2.499) 3(7.5,2.499) 4(-7.5,2.499)
LED-SEG-TH_FJ5461AH
  round 1.55 hole 0.9: 1(-6.35,-7.62) 2(-3.81,-7.62) 3(-1.27,-7.62) 4(1.27,-7.62) 5(3.81,-7.62) 6(6.35,-7.62) 7(6.35,7.62) 8(3.81,7.62) 9(1.27,7.62) 10(-1.27,7.62) 11(-3.81,7.62) 12(-6.35,7.62)
LED-SMD_4P-L2.0-W1.3-BR
  rect 0.55x0.55 smd: 1(0.775,-0.4) 2(-0.775,-0.4) 3(0.775,0.4) 4(-0.775,0.4)
LED_0805
  rect 1x1.25 smd: 1(-1.15,0.005) 2(1.05,0.005)
LQFP-48_L7.0-W7.0-P0.50-LS9.0-BL
  oval 0.27x1.5 smd: 1(-2.75,-4.25) 2(-2.25,-4.25) 3(-1.75,-4.25) 4(-1.25,-4.25) 5(-0.75,-4.25) 6(-0.25,-4.25) 7(0.25,-4.25) 8(0.75,-4.25) 9(1.25,-4.25) 10(1.75,-4.25) 11(2.25,-4.25) 12(2.75,-4.25) 25(2.75,4.25) 26(2.25,4.25) 27(1.75,4.25) 28(1.25,4.25) 29(0.75,4.25) 30(0.25,4.25) 31(-0.25,4.25) 32(-0.75,4.25) 33(-1.25,4.25) 34(-1.75,4.25) 35(-2.25,4.25) 36(-2.75,4.25)
  oval 1.5x0.27 smd: 13(4.25,-2.75) 14(4.25,-2.25) 15(4.25,-1.75) 16(4.25,-1.25) 17(4.25,-0.75) 18(4.25,-0.25) 19(4.25,0.25) 20(4.25,0.75) 21(4.25,1.25) 22(4.25,1.75) 23(4.25,2.25) 24(4.25,2.75) 37(-4.25,2.75) 38(-4.25,2.25) 39(-4.25,1.75) 40(-4.25,1.25) 41(-4.25,0.75) 42(-4.25,0.25) 43(-4.25,-0.25) 44(-4.25,-0.75) 45(-4.25,-1.25) 46(-4.25,-1.75) 47(-4.25,-2.25) 48(-4.25,-2.75)
M2螺丝
  round 2 hole 2: 1(0,0)
QFN-24_L4.0-W4.0-P0.50-TL-EP2.6
  oval 0.8x0.28 smd: 1(-2,1.25) 2(-2,0.75) 3(-2,0.25) 4(-2,-0.25) 5(-2,-0.75) 6(-2,-1.25) 13(2,-1.25) 14(2,-0.75) 15(2,-0.25) 16(2,0.25) 17(2,0.75) 18(2,1.242)
  oval 0.28x0.8 smd: 7(-1.25,-2) 8(-0.75,-2) 9(-0.25,-2) 10(0.25,-2) 11(0.75,-2) 12(1.25,-2) 19(1.25,2) 20(0.75,2) 21(0.25,2) 22(-0.25,2) 23(-0.75,2) 24(-1.25,2)
  rect 2.7x2.7 smd: 25(0,-0.013)
R0805
  rect 1.133x1.377 smd: 1(-1,0) 2(1,0)
RES-TH_L5.1-W4.3-P3.40-D0.5
  round 1.524 hole 0.762: 1(0,1.7) 2(0,-1.7)
S8550P_SOT
  rect 1.25x0.701 smd: 1(1.292,-0.95) 2(1.292,0.95) 3(-1.208,0)
SOIC-8_L4.9-W3.9-P1.27-LS6.0-BL
  oval 0.588x2.045 smd: 1(-1.905,-2.772) 2(-0.635,-2.772) 3(0.635,-2.772) 4(1.905,-2.772) 5(1.905,2.772) 6(0.635,2.772) 7(-0.635,2.772) 8(-1.905,2.772)
SOIC-8_L5.3-W5.3-P1.27-LS8.0-BL
  oval 0.63x2.25 smd: 1(-1.905,-3.53) 2(-0.635,-3.53) 3(0.635,-3.53) 4(1.905,-3.53) 5(1.905,3.53) 6(0.635,3.53) 7(-0.635,3.53) 8(-1.905,3.53)
SOP_BCON
  oval 1.2x0.5 smd: 1(0,0) 2(0,-0.9) 3(0,-1.8) 4(2,-1.8) 5(2,0)
SOT-23-5_L2.9-W1.6-P0.95-LS2.8-BL
  rect 0.6x1 smd: 1(-0.95,-1.1) 2(0,-1.1) 3(0.95,-1.1) 4(0.95,1.1) 5(-0.95,1.1)
SPK-TH_BD23.0-P10.00-D0.8-L-RD
  rect 2.5x2.5 hole 1.1: 1(-5,0)
  round 2.5 hole 1.1: 2(5,0)
SSOP-20_L7.2-W5.3-P0.65-LS7.8-BL
  oval 0.364x2.082 smd: 1(-2.925,-3.491) 2(-2.275,-3.491) 3(-1.625,-3.491) 4(-0.975,-3.491) 5(-0.325,-3.491) 6(0.325,-3.491) 7(0.975,-3.491) 8(1.625,-3.491) 9(2.275,-3.491) 10(2.925,-3.491) 11(2.925,3.491) 12(2.275,3.491) 13(1.625,3.491) 14(0.975,3.491) 15(0.325,3.491) 16(-0.325,3.491) 17(-0.975,3.491) 18(-1.625,3.491) 19(-2.275,3.491) 20(-2.925,3.491)
USB_TYPE-C-16P
  oval 1.2x2 hole 0.7x1.7: 1(-4.193,1.765) 2(4.447,1.765)
  oval 1.2x1.8 hole 0.7x1.4: 3(-4.193,-2.415) 4(4.447,-2.415)
  rect 0.3x1.3 smd: A1(-3.223,2.415) A4(-2.423,2.415) A5(-1.123,2.415) A6(-0.123,2.415) A7(0.377,2.415) A8(1.377,2.415) A9(2.677,2.415) A12(3.477,2.415) B1(3.177,2.415) B4(2.377,2.415) B5(1.877,2.415) B6(0.877,2.415) B7(-0.623,2.415) B8(-1.623,2.415) B9(-2.123,2.415) B12(-2.923,2.415)

## Nets
As in the schematic.

Pads without a net: U3 1 10 11 12 13 14 15 16 17 18 19 22 23 24; U5 3 4; U6 4; U10 2 5 6; U11 6 20; U15 4; USB1 A8 B8

## Via types
v1: diameter 0.635, hole 0.381, Top Layer to Bottom Layer, 229 vias

## Routing (per net, layer and track width the routed paths; a pad name or vN(x,y) marks a point on that pad's centre or on a via; arc(x,y) is an arc through that point)
+3V3: length 392.3
  Top Layer w0.254: v1(45.78,28.79) 48.35,28.79 48.64,29.08 C31.2 ; v1(45.78,28.79) 42.12,28.79 41.78,28.45 41.78,28.12 41.47,27.81 40.64,27.81 40.28,28.18 40.28,31.73 39.88,32.13 36.07,32.13 35.81,32.39 C28.1 ; v1(45.78,28.79) U10.24 45.78,17.32 R23.2 50.02,17.25 C30.1
  Top Layer w0.381: U16.8 25.65,21.08 25.3,20.73 C23.1 v1(22.35,20.73) ; C7.1 42.54,6.1 42.67,5.97 42.67,5.21 42.85,5.03 U11.5 46.41,5.03 46.74,4.7 46.74,2.16 46.35,1.78 44.26,1.78 44.26,1.78 42.68,1.78 42.54,1.91 C4.2 C5.2 v1(38.23,1.91) ; 56.19,36.67 v1(56.19,37.59) ; R17.1 v1(81.28,43.82) ; R13.1 32.06,17.45 v1(32,17.4) ; 29.24,1.78 30.86,1.78 31.12,2.03 31.12,2.79 30.86,3.05 U12.7 ; 52.77,36.67 v1(52.77,37.59) ; C17.2 21.14,3.88 21.46,3.56 25.4,3.56 25.78,3.18 25.78,1.79 ; 63.05,36.67 v1(63.05,37.59) ; 59.62,36.67 v1(59.62,37.59) ; 25.78,1.79 C6.2 ; 25.78,1.79 25.8,1.78 U12.8 ; R16.1 v1(81.28,31.27) ; R14.1 v1(81.28,6.11) ; 51.24,5.68 52.92,5.68 53.72,6.48 v1(53.72,9.91) ; R15.1 v1(81.28,18.79) ; R12.2 v1(57.23,9.91) ; v1(27.05,34.8) R30.2 R29.2 ; v1(21.97,18.72) R21.2
  Bottom Layer w0.381: v1(81.28,6.11) v1(81.28,18.79) 81.28,21.79 ; v1(27.05,34.8) 27.05,33.66 26.8,33.4 25.65,33.4 24.77,32.51 24.77,30.61 24,29.84 18.54,29.84 18.16,29.46 ; 18.16,29.46 18.16,25.48 18.54,25.09 19.33,25.09 ; 18.16,29.46 7.07,29.46 ; R34.1 21.34,12.4 ; 21.08,17.4 v1(32,17.4) ; 19.33,25.09 19.79,24.64 19.81,24.64 ; 19.33,25.09 20.45,25.09 ; v1(53.72,9.91) v1(57.23,9.91) 60.83,9.91 61.21,10.29 61.21,14.22 60.58,14.86 58.8,14.86 58.17,15.49 58.17,21.8 58.21,21.84 ; 20.7,13.84 42.93,13.84 43.69,14.61 43.69,21.21 44.32,21.84 58.21,21.84 ; 45.78,26.03 52.58,26.03 52.83,26.29 52.83,37.53 v1(52.77,37.59) v1(56.19,37.59) v1(59.62,37.59) v1(63.05,37.59) ; 45.78,26.03 v1(45.78,28.79) ; 45.78,26.03 37.72,26.03 37.08,25.4 37.08,23.37 36.45,22.73 29.21,22.73 28.75,23.19 28.75,24.71 ; 7.07,29.46 7.11,29.5 7.11,41.78 7.87,42.54 H3.3 ; 7.07,29.46 5.33,29.46 4.32,30.48 4.32,35.18 3.92,35.58 H2.2 ; 22.33,20.75 v1(22.35,20.73) 20.83,20.73 ; 81.28,21.79 81.22,21.84 74.26,21.84 ; 81.28,21.79 v1(81.28,31.27) v1(81.28,43.82) ; 74.26,21.84 74.26,5.55 73.79,5.08 72.9,5.08 72.52,4.7 H1.5 ; 74.26,21.84 58.21,21.84
  vias: v1(16.51,20.57) v1(17.3,20.57) v1(20.19,10.92) v1(20.19,10.22) v1(20.19,9.53) v1(20.89,10.92) v1(20.89,10.22) v1(20.89,9.53) v1(21.59,10.92) v1(21.59,10.22) v1(21.59,9.53) v1(27.69,27.81) v1(28.57,27.81)
GND: length 39.4
  Top Layer w0.254: 16.89,26.39 U3.2 19.83,26.39 19.83,25.62 ; v1(49.66,8.89) 49.66,7.11 49.79,6.97 U11.19 ; 47.28,28.29 48.64,28.29 ; U5.7 11.43,36.44 U5.2 ; 8,18.8 8,20.82 USB1.B1 USB1.A12 7.42,19.55 USB1.2 ; 45.28,19.81 45.28,21.79 ; U10.47 40.78,28.96 ; C5.1 C4.1
  Top Layer w0.381: 37.34,28.45 v1(36.9,28.45) 36.29,28.45 35.94,28.8 35.94,29.34 v1(35.56,29.72) 34.18,29.72 ; v1(36.07,25.27) 35.81,25.02 v1(35.81,24.41) 35.81,24 v1(35.47,23.66) 35.18,23.37 34.15,23.37 ; 34.15,23.37 C21.1 ; 34.15,23.37 33.02,23.37 v1(32.77,23.62) 32.77,24 32.51,24.26 v1(31.37,24.26) 30.86,24.26 30.61,24.51 v1(30.61,25.78) v1(30.61,26.83) v1(30.61,27.83) 30.61,28.45 v1(31.12,28.96) v1(32.03,28.96) 32.38,28.96 v1(32.78,29.35) 33.15,29.72 34.18,29.72 ; 34.18,29.72 C20.1
  vias: v1(1.27,26.03) v1(1.27,25.15) v1(1.27,24.26) v1(1.27,23.37) v1(1.27,22.48) v1(1.27,21.59) v1(2.16,26.03) v1(2.16,25.15) v1(2.16,24.26) v1(2.16,23.37) v1(2.16,22.48) v1(2.16,21.59) v1(9.4,23.37) v1(9.53,25.27) v1(10.41,25.27) v1(10.41,23.37) v1(11.37,25.27) v1(11.37,23.37) v1(12.25,25.27) v1(12.25,23.37) v1(13.21,25.27) v1(13.33,22.86) v1(14.17,25.27) v1(14.56,37.08) v1(14.73,32.89) v1(14.73,26.16) v1(14.86,23.24) v1(15.62,26.67) v1(16.51,26.67) v1(20.19,34.29) v1(22.86,27.56) v1(22.86,26.67) v1(23.5,15.37) v1(23.75,27.56) v1(23.75,26.67) v1(24.26,11.3) v1(24.26,10.41) v1(25.15,11.3) v1(25.15,10.41) v1(25.4,36.96) v1(25.4,36.07) v1(25.4,35.18) v1(25.4,34.35) v1(26.03,11.3) v1(26.03,10.41) v1(26.03,9.53) v1(26.03,8.64) v1(26.03,7.75) v1(26.03,6.86) v1(26.03,5.97) v1(26.03,5.08) v1(26.92,11.3) v1(26.92,10.41) v1(26.92,9.53) v1(26.92,8.64) v1(26.92,7.75) v1(26.92,6.86) v1(26.92,5.97) v1(26.92,5.08) v1(27.81,11.3) v1(27.81,10.41) v1(28.7,11.3) v1(28.7,10.41) v1(30.61,24.8) v1(30.62,20.85) v1(30.62,19.16) v1(32.26,24.26) v1(34.8,5.59) v1(35.81,41.91) v1(35.94,29.05) v1(36.83,53.97) v1(36.83,53.09) v1(36.83,52.2) v1(36.83,51.31) v1(36.83,50.42) v1(36.83,49.53) v1(37.72,53.97) v1(37.72,53.09) v1(37.72,52.2) v1(37.72,51.31) v1(37.72,50.42) v1(37.72,49.53) v1(39.12,31.37) v1(40.39,4.83) v1(41.02,28.58) v1(42.42,8.38) v1(42.8,27.69) v1(46.74,20.45) v1(46.74,19.56) v1(47.62,20.45) v1(47.62,19.56) v1(48.51,20.45) v1(48.51,19.56) v1(49.02,34.16) v1(49.28,2.67) v1(49.4,20.45) v1(49.4,19.56) v1(50.29,20.45) v1(50.29,19.56) v1(58.67,6.1) v1(58.67,2.79) v1(87.88,51.18) v1(87.88,50.29) v1(87.88,40.89) v1(87.88,40) v1(87.88,28.58) v1(87.88,27.69) v1(87.88,15.37) v1(87.88,14.48) v1(88.77,51.18) v1(88.77,50.29) v1(88.77,40.89) v1(88.77,40) v1(88.77,28.58) v1(88.77,27.69) v1(88.77,15.37) v1(88.77,14.48)
VBUS: length 14.8
  Top Layer w0.254: v1(9.4,8.25) R19.1
  Bottom Layer w0.254: v1(9.4,8.25) 11.56,8.25 11.93,8.62 11.93,14.72 12.26,15.06 v1(16.68,15.06)
+VS: length 32.7
  Top Layer w0.254: 13.97,34.99 14.03,35.05 R28.1
  Top Layer w0.381: 22.22,31.75 25.78,31.75 26.39,31.14 Q5.2 27.18,32.84 R31.2 ; 22.22,31.75 12.83,31.75 12.43,32.15 C24.2 13.61,33.08 13.97,33.44 13.97,36.07 13.6,36.44 U5.5 ; 22.22,31.75 22.22,33 C26.2 23.5,33.02 23.88,33.4 23.88,36.07 23.62,36.32 U6.5
AM_BUSY: length 45.6
  Top Layer w0.254: 47.28,25.29 53.83,25.29 54.74,24.38 v1(54.74,17.65) ; v1(59.56,1.78) v1(59.56,11.43) ; 51.24,1.78 51.24,1.78 v1(49.91,1.78)
  Bottom Layer w0.254: v1(54.74,17.65) 54.74,12.57 55.12,12.19 58.8,12.19 v1(59.56,11.43) ; v1(49.91,1.78) v1(59.56,1.78)
AM_CLK: length 64.1
  Top Layer w0.254: v1(52.45,16.13) 52.45,23.24 51.9,23.79 47.28,23.79 ; v1(45.97,2.79) 45.6,2.43 U11.9
  Bottom Layer w0.254: v1(52.45,16.13) 52.45,12.38 51.68,11.61 38.67,11.61 37.91,10.85 31.04,10.85 29.97,9.78 29.97,3.68 30.34,3.31 45.45,3.31 v1(45.97,2.79)
AM_CS: length 60.4
  Top Layer w0.254: 47.28,23.29 51.26,23.29 51.69,22.86 v1(51.69,15.11) ; v1(42.67,2.67) 43.08,3.07 U11.8
  Bottom Layer w0.254: v1(51.69,15.11) 51.69,12.58 51.18,12.06 38.48,12.06 37.72,11.3 30.61,11.3 29.34,10.03 29.34,3.3 29.97,2.67 v1(42.67,2.67)
AM_DAT: length 62.6
  Top Layer w0.254: v1(53.97,16.13) 53.97,24 53.19,24.79 47.28,24.79 ; v1(42.67,4.19) 43.14,3.72 U11.7
  Bottom Layer w0.254: v1(53.97,16.13) 53.59,16.13 53.21,15.75 53.21,12.04 52.32,11.15 38.86,11.15 38.1,10.39 31.47,10.39 30.59,9.51 30.59,4.19 30.85,3.94 42.42,3.94 v1(42.67,4.19)
AM_RST: length 31.2
  Top Layer w0.254: v1(55.23,11.43) R12.1 C2.1 54.1,6.1 53.85,5.84 53.85,4.19 53.38,3.72 U11.14 ; v1(53.97,14.86) 53.47,14.86 53.21,15.11 53.21,23.62 52.55,24.29 47.28,24.29
  Bottom Layer w0.254: v1(53.97,14.86) 53.97,11.94 54.48,11.43 v1(55.23,11.43)
COM1: length 19.5
  Top Layer w0.254: R24.1 61.15,30.29 60.5,29.64 54.94,29.64 54.71,29.42 54.71,27.25 53.25,25.79 47.28,25.79
COM2: length 15.8
  Top Layer w0.254: R25.1 57.75,30.44 57.4,30.1 54.75,30.1 54.25,29.61 54.25,27.43 53.11,26.29 47.28,26.29
COM3: length 12.2
  Top Layer w0.254: R26.1 54.29,30.29 53.8,29.79 53.8,27.62 52.96,26.79 47.28,26.79
COM4: length 13.1
  Top Layer w0.254: 47.28,27.29 52.81,27.29 53.34,27.81 53.34,29.84 52.83,30.35 51.31,30.35 50.93,30.73 50.93,32.78
I2C_SCL: length 72.6
  Top Layer w0.254: U5.6 13.64,37.39 13.84,37.59 13.84,38.1 14.07,38.32 15.33,38.32 arc(15.51,38.4) 15.59,38.58 15.59,38.61 arc(15.84,38.86) 16.1,38.61 16.1,38.58 arc(16.35,38.32) 16.61,38.58 16.61,38.61 arc(16.86,38.86) 17.11,38.61 17.11,38.58 arc(17.37,38.32) 17.62,38.58 17.62,38.61 arc(17.88,38.86) 18.13,38.61 18.13,38.58 arc(18.38,38.32) 18.64,38.58 18.64,38.61 arc(18.89,38.86) 19.14,38.61 19.14,38.58 arc(19.4,38.32) 19.65,38.58 19.65,38.61 arc(19.91,38.86) 20.16,38.61 20.16,38.58 arc(20.42,38.32) 20.67,38.58 20.67,38.61 arc(20.92,38.86) 21.18,38.61 21.18,38.58 arc(21.25,38.4) 21.43,38.32 23.37,38.32 ; v1(24.77,29.46) 24.77,26.67 25.27,26.16 27.81,26.16 28.19,25.78 U16.6 ; 27,40.26 v1(29.97,40.26) 32.36,40.26 33.02,39.6 33.02,34.92 33.66,34.29 35.94,34.29 36.32,33.91 36.32,33.4 36.63,33.1 41.33,33.1 41.78,32.64 U10.45 ; 27,40.26 25.53,40.26 25.27,40 25.27,39.12 24.48,38.32 23.37,38.32 ; 27,40.26 27.05,40.21 R30.1 ; 23.37,38.32 23.37,37.34 23.15,37.12 U6.6
  Bottom Layer w0.254: v1(24.77,29.46) 25.65,29.46 26.17,29.98 26.17,31.51 26.8,32.13 28.96,32.13 28.96,32.13 29.58,32.12 29.97,32.51 v1(29.97,40.26)
I2C_SDA: length 71.1
  Top Layer w0.254: v1(9.27,38.48) 9.27,37.59 9.48,37.39 U5.1 ; U6.3 v1(19.69,35.52) ; R29.1 v1(29.21,39.5) 32.07,39.5 32.51,39.05 32.51,34.54 33.27,33.78 35.69,33.78 35.87,33.6 35.87,33.1 36.32,32.64 40.89,32.64 41.28,32.26 41.28,30.29 ; v1(25.53,30.73) 25.53,27.05 25.91,26.67 29.08,26.67 29.46,26.29 U16.5
  Bottom Layer w0.254: 19.69,38.48 24.64,38.48 24.89,38.73 24.89,39.24 25.15,39.5 v1(29.21,39.5) 29.21,32.89 28.96,32.64 26.29,32.64 25.53,31.88 v1(25.53,30.73) ; 19.69,38.48 v1(19.69,35.52) ; 19.69,38.48 v1(9.27,38.48)
KEY1: length 78.6
  Top Layer w0.254: v1(40.26,24.64) 39.91,24.29 U10.10 ; 79.89,9.05 79.89,8.13 R14.2 ; 79.89,9.05 79.89,9.06 ; 79.89,9.05 79.9,9.06 ; 79.89,9.06 C8.1 ; 79.89,9.06 79.9,9.06 ; 79.89,9.06 77.68,9.06 77.22,9.53 77.22,11.43 76.43,12.22 40.36,12.22 39.12,13.46 v1(39.12,16.13) ; SW1.2 SW1.1 79.9,9.06
  Bottom Layer w0.254: v1(40.26,24.64) 39.93,24.31 38.66,24.31 38.2,23.85 38.2,17.19 38.63,16.76 38.99,16.76 39.12,16.64 v1(39.12,16.13)
KEY2: length 82.7
  Top Layer w0.254: 39.88,15.37 39.88,13.59 40.79,12.67 76.07,12.67 77.11,13.72 77.11,21.36 77.38,21.63 79.91,21.63 ; 79.91,21.65 79.91,20.81 R15.2 ; 79.91,21.65 C9.1 ; 79.91,21.65 79.93,21.63 SW2.1 SW2.2 ; U10.11 v1(40.51,23.79)
  Bottom Layer w0.254: v1(39.88,15.49) 39.88,17.02 39.62,17.28 39,17.26 38.66,17.6 38.66,23.42 39.03,23.79 v1(40.51,23.79)
KEY3: length 92.2
  Top Layer w0.254: 79.89,34.2 79.89,34.2 ; 79.89,34.2 79.89,34.2 ; 79.89,34.2 SW3.1 SW3.2 ; 79.89,34.2 79.89,34.2 ; 79.89,34.2 77.13,34.2 76.66,33.73 76.66,13.91 75.88,13.13 41.22,13.13 40.64,13.72 v1(40.64,16.13) ; 79.89,34.2 C10.1 ; U10.12 39.83,23.29 v1(40,23.11) ; 79.89,34.2 79.89,33.28 R16.2
  Bottom Layer w0.254: v1(40.64,16.13) 40.64,17.4 40.19,17.85 39.3,17.85 39.12,18.03 39.12,22.86 39.37,23.11 v1(40,23.11)
KEY4: length 100.3
  Top Layer w0.254: C11.1 79.91,46.79 ; 40.28,21.79 40.28,20.7 40.15,20.57 v1(39.88,20.57) ; R17.2 79.91,45.84 79.91,46.78 ; v1(41.4,15.49) 41.4,13.84 41.66,13.59 75.69,13.59 76.2,14.1 76.2,45.97 77,46.78 79.91,46.78 ; SW4.2 SW4.1 79.91,46.78
  Bottom Layer w0.254: v1(41.4,15.49) 41.4,18.03 41.02,18.42 40.13,18.42 39.88,18.67 v1(39.88,20.57)
LED1: length 7.5
  Top Layer w0.254: LED2.1 42.19,15.72 41.91,16 41.91,18.42 41.28,19.05 41.28,21.79
LED2: length 5.6
  Top Layer w0.254: LED2.2 43.31,17.29 43.31,18.54 43.05,18.8 42.29,18.8 41.78,19.31 U10.16
LED3: length 5.9
  Top Layer w0.254: LED2.4 44.07,17.29 44.07,18.92 43.69,19.3 42.54,19.3 42.28,19.57 42.28,21.79
PWR_EN: length 27.6
  Top Layer w0.254: Q5.1 29.08,32.84 R31.1 29.13,34.04 29.38,34.29 31.37,34.29 31.62,34.54 v1(31.62,35.81) ; v1(46.1,32.89) 45.72,32.89 45.28,32.45 45.28,30.29
  Bottom Layer w0.254: v1(46.1,32.89) 46.1,35.69 45.72,36.07 31.88,36.07 v1(31.62,35.81)
RES_PHOTO: length 13.2
  Top Layer w0.254: R34.2 34.75,15.11 37.68,15.11 R35.1 37.72,15.12 37.72,18.16 38.1,18.54 40.26,18.54 40.78,19.06 U10.14
RXD: length 35.8
  Top Layer w0.254: v1(20.83,28.58) 20.58,28.33 U3.20 ; 44.28,21.79 44.28,23.11 44.7,23.54 44.7,26.67 v1(44.45,26.92)
  Bottom Layer w0.254: v1(44.45,26.92) 44.2,27.18 44.2,28.96 43.89,29.26 36.78,29.26 36.19,29.85 36.19,30.78 35.94,31.04 27.43,31.04 27.18,30.78 27.18,29.08 26.42,28.32 24.13,28.32 23.69,28.77 21.02,28.77 v1(20.83,28.58)
SEGA: length 41.6
  Top Layer w0.254: v1(41.66,25.15) 41.66,23.24 41.91,22.99 42.54,22.99 42.78,22.75 U10.18 ; v1(67.82,34.8) R1.1
  Bottom Layer w0.254: v1(41.66,25.15) 67.82,25.15 v1(67.82,34.8)
SEGB: length 42.6
  Top Layer w0.254: v1(69.98,34.8) R2.1 ; v1(42.42,24.38) 42.42,23.62 42.54,23.5 42.92,23.5 43.28,23.13 43.28,21.79
  Bottom Layer w0.254: v1(42.42,24.38) 69.67,24.38 69.98,24.69 v1(69.98,34.8)
SEGC: length 42.8
  Top Layer w0.254: v1(72.14,34.8) R3.1 ; U10.20 43.78,23.58 v1(43.81,23.62)
  Bottom Layer w0.254: v1(43.81,23.62) 71.88,23.62 72.14,23.88 v1(72.14,34.8)
SEGD: length 8.9
  Top Layer w0.254: R4.1 48.01,34.29 47.62,33.91 45.09,33.91 44.78,33.6 U10.39
SEGDP: length 8.9
  Top Layer w0.254: U10.43 42.78,33.42 42.11,34.09 39.7,34.09 39.37,34.42 R8.1
SEGE: length 7.2
  Top Layer w0.254: 44.28,30.29 44.28,33.86 44.83,34.42 45.59,34.42 45.85,34.67 R5.1
SEGF: length 6.1
  Top Layer w0.254: U10.41 43.78,36.3 R6.1
SEGG: length 7.3
  Top Layer w0.254: R7.1 41.53,34.8 41.78,34.54 42.54,34.54 43.28,33.81 43.28,30.29
SPI_CS_AM: length 55.5
  Top Layer w0.254: v1(42.8,9.14) 38.86,9.14 arc(38.68,9.22) 38.61,9.4 38.61,9.78 arc(38.35,10.03) 38.1,9.78 38.1,9.4 arc(37.85,9.14) 37.59,9.4 37.59,9.78 arc(37.34,10.03) 37.08,9.78 37.08,9.4 arc(36.83,9.14) 36.58,9.4 36.58,9.78 arc(36.32,10.03) 36.07,9.78 36.07,9.4 arc(35.81,9.14) 35.56,9.4 35.56,9.78 arc(35.31,10.03) 35.05,9.78 35.05,9.4 arc(34.98,9.22) 34.8,9.14 33.4,9.14 32.89,8.64 32.89,8.31 arc(32.82,8.13) 32.64,8.05 32.26,8.05 arc(32,7.8) 32.26,7.55 32.64,7.55 arc(32.89,7.29) 32.64,7.04 32.26,7.04 arc(32,6.78) 32.26,6.53 32.64,6.53 arc(32.82,6.46) 32.89,6.28 32.89,2.16 33.27,1.78 U12.1 ; U11.3 v1(45.97,6.32)
  Bottom Layer w0.254: v1(42.8,9.14) 45.59,9.14 45.97,8.76 v1(45.97,6.32) 45.97,4.32 46.74,3.56 62.1,3.56 62.36,3.3 H1.1
SPI_MISO: length 55.2
  Top Layer w0.254: 44.26,7.62 41.79,7.62 arc(41.61,7.69) 41.53,7.87 41.53,8.25 arc(41.28,8.51) 41.03,8.25 41.03,7.87 arc(40.77,7.62) 40.52,7.87 40.52,8.25 arc(40.26,8.51) 40.01,8.25 40.01,7.87 arc(39.76,7.62) 39.5,7.87 39.5,8.25 arc(39.25,8.51) 38.99,8.25 38.99,7.87 arc(38.74,7.62) 38.49,7.87 38.49,8.25 arc(38.23,8.51) 37.98,8.25 37.98,7.87 arc(37.72,7.62) 37.47,7.87 37.47,8.25 arc(37.22,8.51) 36.96,8.25 36.96,7.87 arc(36.71,7.62) 36.45,7.87 36.45,8.25 arc(36.2,8.51) 35.95,8.25 35.95,7.87 arc(35.69,7.62) 35.44,7.87 35.44,8.25 arc(35.18,8.51) 34.93,8.25 34.93,7.87 arc(34.86,7.69) 34.68,7.62 34.16,7.62 33.91,7.37 33.91,3.3 34.16,3.05 U12.2 ; 44.26,7.62 46.61,7.62 46.86,7.87 48.01,7.87 48.53,7.35 48.53,1.13 48.9,0.76 64.64,0.76 64.9,1.02 H1.2 ; 44.26,7.62 U11.1
SPI_MOSI: length 55.5
  Top Layer w0.254: v1(42.67,6.86) 42.79,6.97 U11.2 v1(47.12,6.97) ; v1(32,5.84) 31.75,5.59 29.24,5.59 ; H1.4 69.98,3.81 69.6,4.19 v1(66.29,4.19)
  Bottom Layer w0.254: v1(32,5.84) 32,6.6 32.26,6.86 32.51,6.86 arc(32.69,6.93) 32.77,7.11 32.77,7.62 arc(33.02,7.87) 33.27,7.62 33.27,7.11 arc(33.53,6.86) 33.78,7.11 33.78,7.62 arc(34.04,7.87) 34.29,7.62 34.29,7.11 arc(34.54,6.86) 34.8,7.11 34.8,7.62 arc(35.05,7.87) 35.31,7.62 35.31,7.11 arc(35.56,6.86) 35.81,7.11 35.81,7.62 arc(36.07,7.87) 36.32,7.62 36.32,7.11 arc(36.58,6.86) 36.83,7.11 36.83,7.62 arc(37.08,7.87) 37.34,7.62 37.34,7.11 arc(37.59,6.86) 37.85,7.11 37.85,7.62 arc(38.1,7.87) 38.35,7.62 38.35,7.11 arc(38.43,6.93) 38.61,6.86 v1(42.67,6.86) ; v1(47.12,6.97) 47.12,4.7 47.62,4.19 v1(66.29,4.19)
SPI_SCK: length 55.5
  Top Layer w0.254: 29.24,4.32 31.09,4.32 31.24,4.47 v1(31.24,4.83) ; 44.26,5.68 47.84,5.68 v1(47.88,5.72)
  Bottom Layer w0.254: H1.3 67.44,4.44 67.04,4.84 48.25,4.84 47.88,5.21 v1(47.88,5.72) 47.88,9.55 47.49,9.93 41.39,9.93 arc(41.21,10.01) 41.14,10.19 41.14,10.29 arc(40.89,10.54) 40.63,10.29 40.63,10.19 arc(40.38,9.93) 40.12,10.19 40.12,10.29 arc(39.87,10.54) 39.62,10.29 39.62,10.19 arc(39.54,10.01) 39.36,9.93 31.9,9.93 31.24,9.27 v1(31.24,4.83)
TXD: length 38.1
  Top Layer w0.254: v1(44.96,27.81) 45.21,27.56 45.21,23.4 44.78,22.97 U10.22 ; v1(19.81,28.83) 20.08,28.56 U3.21
  Bottom Layer w0.254: v1(44.96,27.81) 44.96,29.21 44.45,29.72 36.97,29.72 36.65,30.03 36.65,31.04 36.19,31.5 27.05,31.5 26.67,31.11 26.67,29.46 26.02,28.82 24.4,28.82 23.99,29.22 20.21,29.22 v1(19.81,28.83)
USB_DN: length 16.1
  Top Layer w0.254: U3.4 17.31,25.39 17.26,25.43 15.78,25.43 15.62,25.27 15.62,24.6 15.16,24.14 14.59,24.14 arc(14.41,24.06) 14.34,23.88 14.34,23.88 arc(14.08,23.62) 13.83,23.88 13.83,23.88 arc(13.58,24.14) 13.32,23.88 13.32,23.88 arc(13.07,23.62) 12.81,23.88 12.81,23.88 arc(12.74,24.06) 12.56,24.14 9,24.14 8.53,23.67 8.24,23.67 8.19,23.62 USB1.A7 6.35,23.62 6.1,23.88 6.1,24.38 6.33,24.62 USB1.B7
USB_DP: length 15.9
  Top Layer w0.254: v1(8.64,22.99) 8.5,23.12 USB1.B6 ; USB1.A6 8.19,24.12 8.24,24.08 8.37,24.08 8.64,24.35 v1(8.64,25.02) 8.68,24.97 8.68,24.76 8.87,24.58 8.83,24.54 14.99,24.54 15.21,24.77 15.21,25.44 15.61,25.84 17.26,25.84 17.31,25.89 U3.3
  Bottom Layer w0.254: v1(8.64,25.02) v1(8.64,22.99)
$1N1449: length 24.2
  Top Layer w0.254: v1(57.66,46.99) 57.66,40.77 57.33,40.44 55.42,40.44 55.25,40.26 Q3.3
  Bottom Layer w0.254: DS1.8 53.81,47.28 54.1,46.99 v1(57.66,46.99)
$1N1467: length 5.8
  Top Layer w0.254: R5.2 45.85,39.75 45.47,40.13 43.94,40.13 43.69,40.39 43.69,42.34 DS1.1
$1N1471: length 5.3
  Top Layer w0.254: R4.2 48.01,40 47.5,40.51 46.61,40.51 46.23,40.89 46.23,42.34 DS1.2
$1N1475: length 13.2
  Top Layer w0.254: v1(39.37,40.51) R8.2
  Bottom Layer w0.254: v1(39.37,40.51) 48.39,40.51 48.73,40.86 DS1.3
$1N1479: length 28.9
  Top Layer w0.254: R3.2 v1(72.14,39.88)
  Bottom Layer w0.254: v1(72.14,39.88) 72.14,44.07 71.5,44.7 51.69,44.7 51.27,44.28 DS1.4
$1N1483: length 16.1
  Top Layer w0.254: v1(41.53,39.75) R7.2
  Bottom Layer w0.254: v1(41.53,39.75) 53.47,39.75 53.85,40.13 53.85,42.34 DS1.5
$1N1487: length 40.1
  Top Layer w0.254: DS1.11 46.19,53.63 46.99,52.83 67.31,52.83 67.82,52.32 R1.2
$1N1491: length 32.2
  Top Layer w0.254: R2.2 69.98,52.96 69.34,53.59 56.9,53.59 56.39,54.1 56.39,57.58 DS1.7
$1N1495: length 26.2
  Top Layer w0.254: v1(48.77,51.31) 42.8,51.31 42.42,50.93 42.42,40 42.8,39.62 43.31,39.62 43.69,39.24 R6.2
  Bottom Layer w0.254: v1(48.77,51.31) 48.77,57.58 DS1.10
$1N6161: length 4.5
  Top Layer w0.254: C1.1 53.85,1.78 53.72,1.91 53.72,2.29 53.58,2.43 U11.12
$1N6192: length 4.3
  Top Layer w0.254: R11.1 54.48,3.94 53.62,3.07 U11.13
$1N6375: length 31.4
  Top Layer w0.381: U11.18 52.68,6.32 52.96,6.6 v1(52.96,8.89)
  Bottom Layer w0.381: 61.55,19.15 65.44,19.15 66.17,18.42 66.17,9.53 65.53,8.89 v1(52.96,8.89)
$1N6384: length 38.5
  Top Layer w0.381: v1(48.64,8.38) 49.05,7.98 49.05,5.31 49.33,5.03 U11.16
  Bottom Layer w0.381: 71.55,19.15 67.66,19.15 66.93,18.42 66.93,9.14 65.96,8.18 48.84,8.18 v1(48.64,8.38)
$1N6917: length 4.5
  Top Layer w0.254: C7.2 38.35,6.1 37.97,5.72 37.97,4.57 37.72,4.32 U12.3
$1N7212: length 10.5
  Top Layer w0.254: R13.2 34.06,18.67 36.92,18.67 37.17,18.92 37.17,24.47 37.49,24.79 U10.9
$1N7925: length 9.3
  Top Layer w0.254: X1.1 32.13,26.84 32.22,26.75 34.17,26.75 ; 34.17,26.75 36.28,26.75 36.42,26.89 36.42,27.41 36.76,27.74 37.85,27.74 37.9,27.79 U10.3 ; 34.17,26.75 C20.2
$1N7930: length 9.3
  Top Layer w0.254: X1.2 32.13,26.25 32.22,26.34 36.45,26.34 36.83,26.72 36.83,27.24 36.93,27.33 37.85,27.33 37.9,27.29 U10.4 ; 34.17,26.26 C21.2
$1N8028: length 10.6
  Top Layer w0.254: R22.1 37.21,34.04 37.62,33.63 41.68,33.63 42.28,33.03 42.28,30.29
$1N8104: length 2.2
  Top Layer w0.254: LED2.3 44.09,15.35 44.2,15.24 45.84,15.24 R23.1
$1N8256: length 36.1
  Top Layer w0.254: Q1.3 62.1,40.13 61.72,40.51 59.94,40.51 59.69,40.77 v1(59.69,45.47)
  Bottom Layer w0.254: v1(59.69,45.47) 44.45,45.47 43.65,46.27 DS1.12
$1N8335: length 25.6
  Top Layer w0.254: v1(58.67,46.23) Q2.3
  Bottom Layer w0.254: DS1.9 51.31,57.58 51.31,46.61 51.69,46.23 v1(58.67,46.23)
$1N8343: length 7.4
  Top Layer w0.254: Q4.3 51.82,40.64 52.07,40.89 56.1,40.89 56.35,41.15 DS1.6
$1N8477: length 1.9
  Top Layer w0.254: 61.15,36.67 R24.2
$1N8481: length 1.9
  Top Layer w0.254: R25.2 57.72,34.76 57.72,36.67
$1N8485: length 1.9
  Top Layer w0.254: 54.29,36.67 R26.2
$1N8489: length 1.9
  Top Layer w0.254: 50.87,36.67 50.87,34.84 R27.2
$1N8598: length 9.3
  Top Layer w0.254: C22.2 36.46,20.83 36.72,21.08 36.72,25.41 37.09,25.79 U10.7
$1N9384: length 6.3
  Top Layer w0.254: C27.2 R28.2 C25.2 18.06,37.12 U6.1
$1N9794: length 82.2
  Top Layer w0.254: R32.1 6.59,34.43 6.35,34.67 v1(5.84,34.67) ; U10.37 45.78,31.81 46.1,32.13 v1(46.99,32.13)
  Bottom Layer w0.254: v1(46.99,32.13) 46.99,36.19 46.61,36.58 31.75,36.58 31.19,37.14 31.19,51.5 30.03,52.65 19.51,52.65 18.92,52.07 18.92,50.29 18.29,49.66 6.98,49.66 5.83,48.5 5.83,34.68 v1(5.84,34.67)
$1N9795: length 2.6
  Top Layer w0.254: R32.2 1.98,33.04
$1N9824: length 79.7
  Top Layer w0.254: 47.28,27.79 49.5,27.79 v1(50.04,28.32) ; v1(6.48,43.43) 6.52,43.39 R33.1
  Bottom Layer w0.254: v1(6.48,43.43) 6.48,48.39 7.29,49.2 18.48,49.2 19.38,50.1 19.38,51.88 19.7,52.2 29.84,52.2 30.73,51.31 30.73,32.39 31.17,31.95 36.38,31.95 37.11,31.23 37.11,31.09 37.11,31.09 37.11,30.33 37.26,30.17 46.15,30.17 46.74,29.59 46.74,28.07 46.99,27.81 49.53,27.81 v1(50.04,28.32)
$1N9825: length 2.5
  Top Layer w0.254: R33.2 H2.4
$1N10135: length 32.6
  Top Layer w0.254: v1(37.85,31.37) 37.85,28.96 38.01,28.79 U10.1 ; H3.2 32.67,45.08 33.53,44.22 33.53,35.43 33.91,35.05 v1(34.67,35.05)
  Bottom Layer w0.254: v1(34.67,35.05) 37.47,35.05 37.85,34.67 v1(37.85,31.37)
$2N394: length 6.2
  Top Layer w0.254: R9.2 9.9,26.54 v1(9.02,26.54) ; USB1.A5 6.25,25.12 v1(6.1,25.27)
  Bottom Layer w0.254: v1(6.1,25.27) 7.75,25.27 8,25.53 8,26.29 8.25,26.54 v1(9.02,26.54)
$2N397: length 2.7
  Top Layer w0.254: USB1.B5 8.48,22.12 8.89,21.72 R10.2
$2N1836: length 3.7
  Top Layer w0.254: R21.1 20.68,22.12 20.32,22.48 19.81,22.48 19.58,22.71 U3.9
$2N6293: length 3.1
  Top Layer w0.254: 14.1,16.56 U17.5
$2N6364: length 20.6
  Top Layer w0.254: LED5.2 1.67,7.1 1.52,7.25 LED4.1 ; U17.1 14.1,12.06 13.84,12.32 v1(12.57,12.32)
  Bottom Layer w0.254: v1(1.52,7.11) 12.19,7.11 12.57,7.49 v1(12.57,12.32)
$2N6379: length 2.4
  Top Layer w0.254: 3.86,5.96 3.87,5.97 R20.2
$2N6385: length 2.5
  Top Layer w0.254: LED4.2 R19.2

## Copper pours and planes (outline as drawn; the poured copper is in the pictures)
+3V3 on Top Layer: 18.67,9.27 21.97,9.27 21.97,4.7 18.67,4.7
+3V3 on Top Layer: 27.31,29.34 28.96,29.34 28.96,27.43 27.31,27.43
+3V3 on Top Layer: 16.15,22.73 17.65,22.73 17.65,20.19 16.15,20.19
+3V3 on Top Layer: 19.81,11.43 21.97,11.43 21.97,9.02 19.81,9.02
+3V3 on Top Layer: 16.15,25.03 18.12,25.03 18.12,21.08 16.15,21.08
+3V3 on Bottom Layer: 19.81,7.49 38.74,7.49 38.74,1.52 19.81,1.52
+3V3 on Bottom Layer: 16.13,20.95 21.97,20.95 21.97,7.24 16.13,7.24
+3V3 on Bottom Layer: 19.18,28.19 28.96,28.19 28.96,20.83 19.18,20.83
GND on Top Layer: 0.13,60.2 100.33,60.2 100.33,-0.13 0.13,-0.13
GND on Bottom Layer: -0.13,60.2 100.08,60.2 100.08,-0.13 -0.13,-0.13
VBAT on Top Layer: 2.67,16.26 16.13,16.26 16.13,7.24 2.67,7.24
VBAT on Top Layer: 14.73,9.02 17.49,9.02 17.49,4.95 14.73,4.95
VBAT on Top Layer: 13.33,10.03 16.13,10.03 16.13,7.24 13.33,7.24
VBUS on Top Layer: 16.08,18.03 17.27,18.03 17.27,14.43 16.08,14.43
VBUS on Top Layer: 7.77,21.77 16.15,21.77 16.15,12.83 7.77,12.83
VBUS on Top Layer: 16.13,24.04 19.23,24.04 19.23,18.03 16.13,18.03
VBUS on Top Layer: 4.19,26.52 8.01,26.52 8.01,21.21 4.19,21.21
$1N10132 on Top Layer: 17.14,52.83 22.48,52.83 22.48,46.61 17.14,46.61

Small or netless copper shapes (teardrops, artwork), in the pictures only: 379 on Top Layer, 114 on Bottom Layer

## Text on the board
Top Silkscreen Layer: SWCLK | SWDIO | CHAG | VBAT | 3V3 | BAT | CS | MISO | SCK | MOSI | GND
